# EAGLE board Layer1 (EAGLE 9.6.1), part 1 of 2
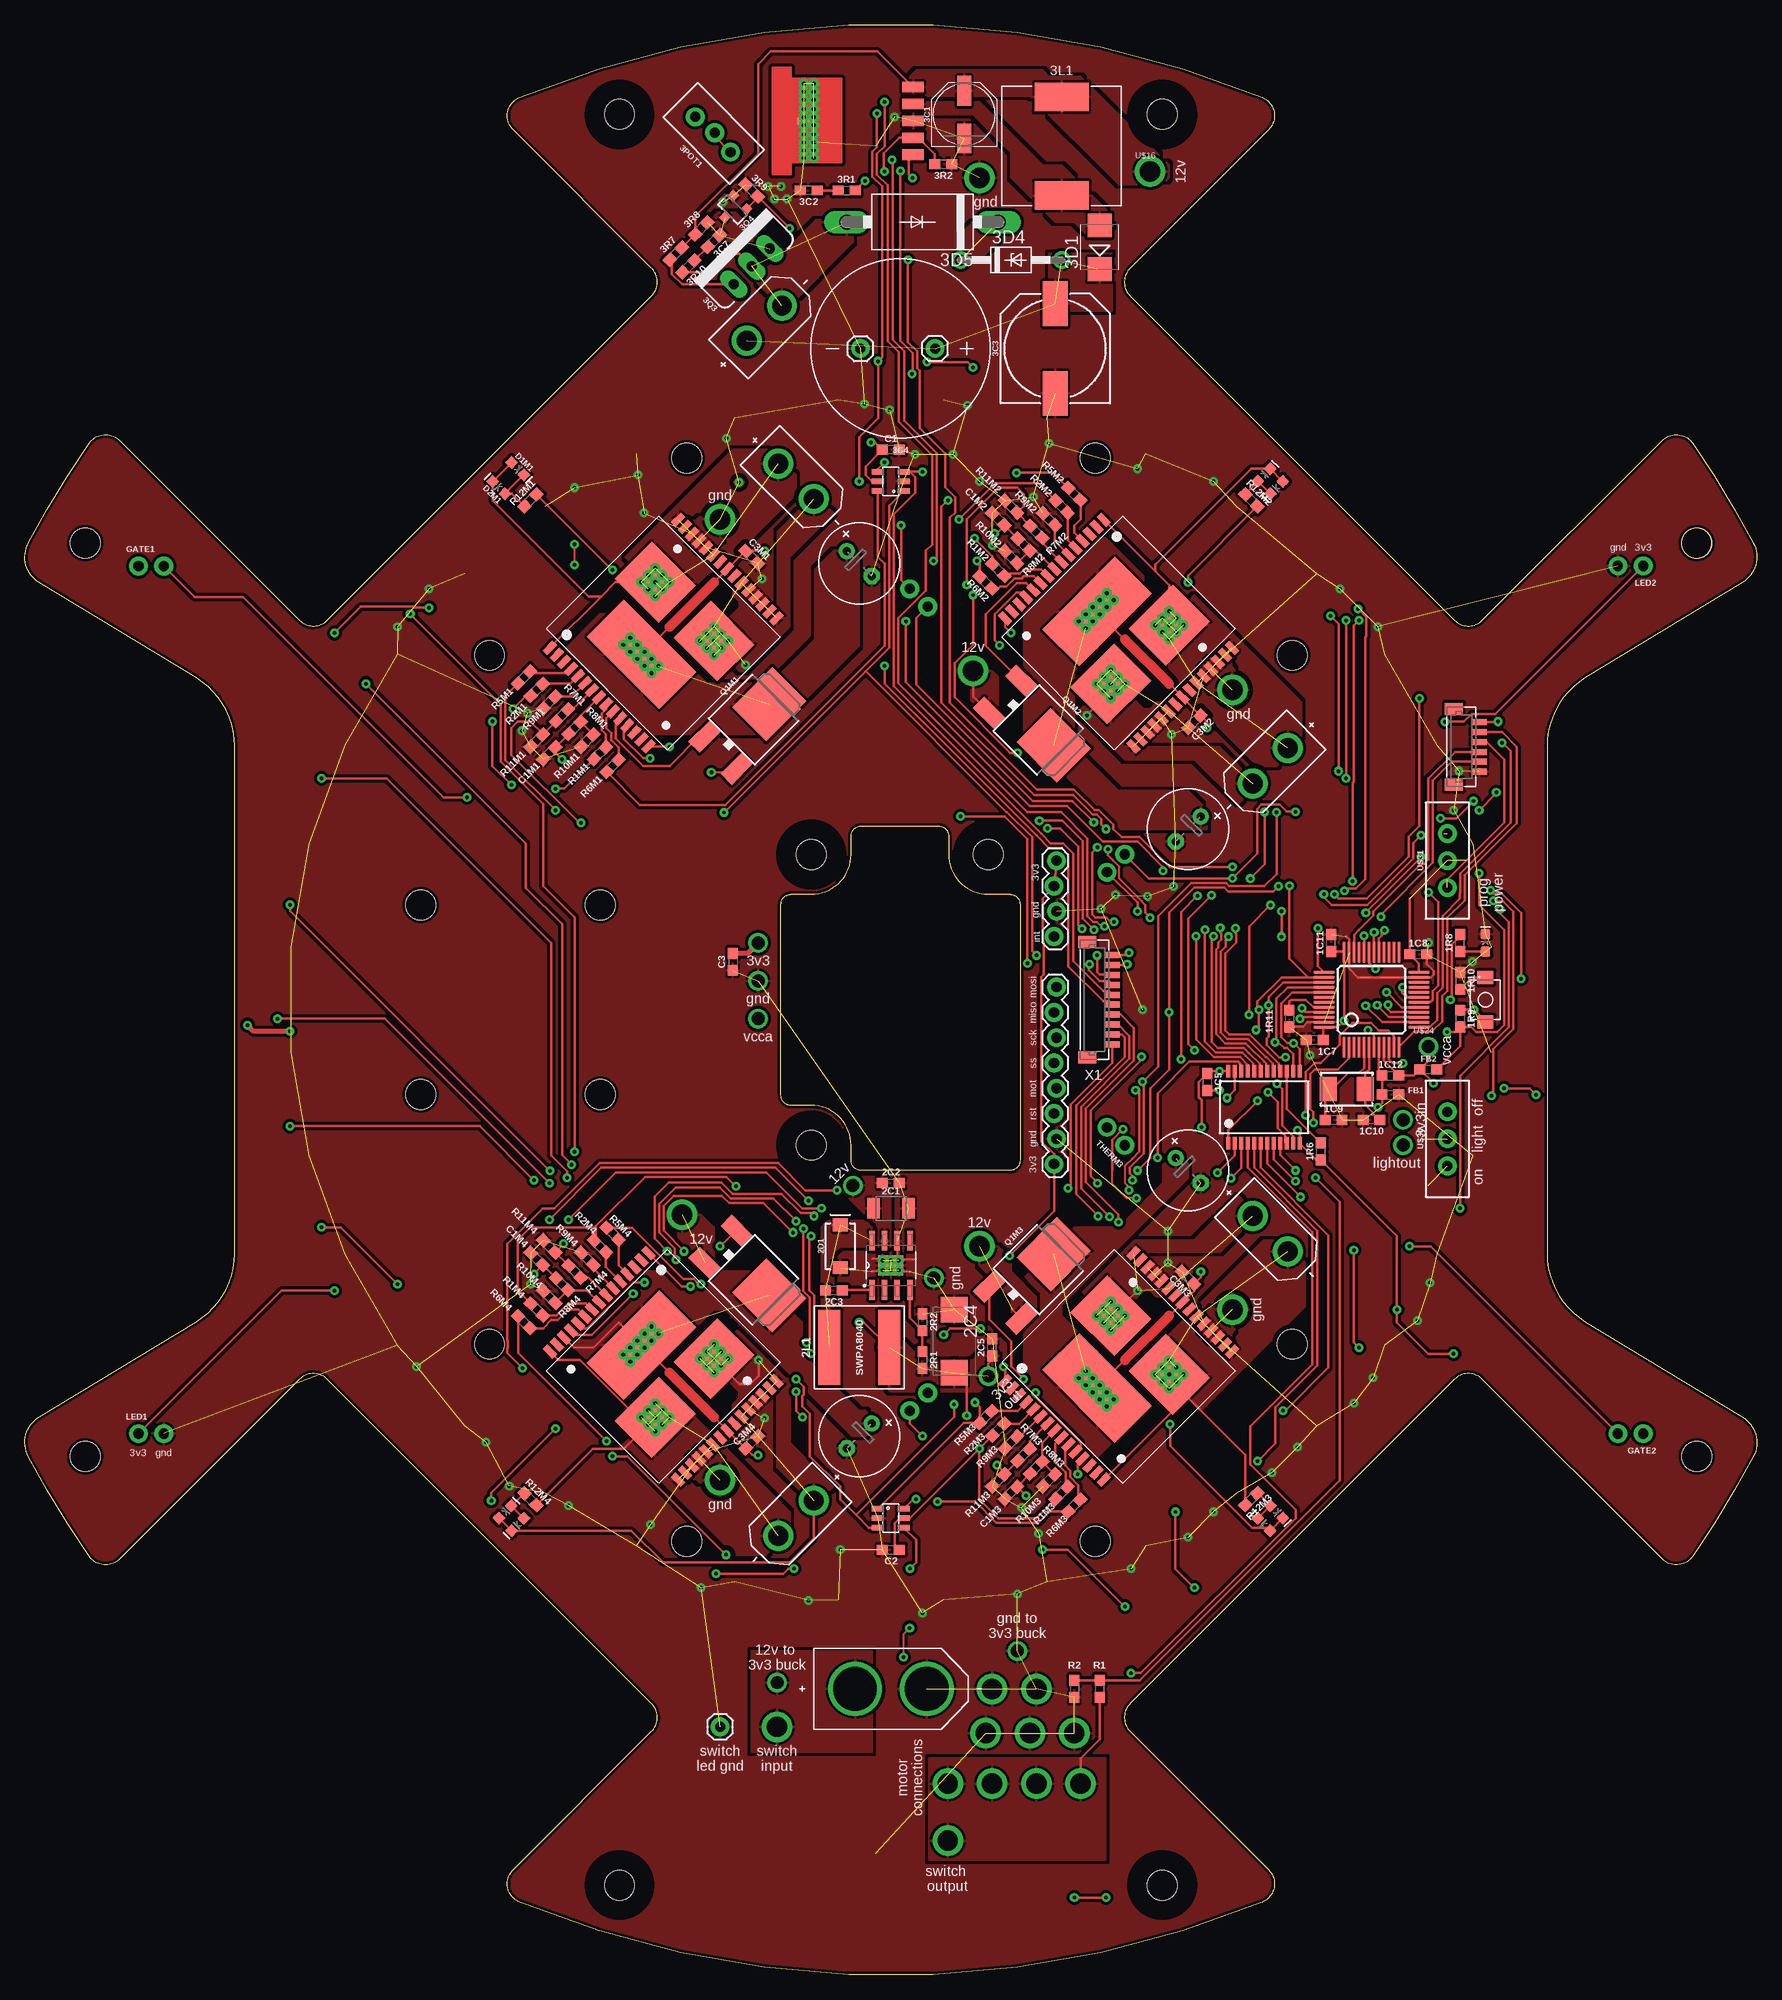
[diagram p5: board, top side]
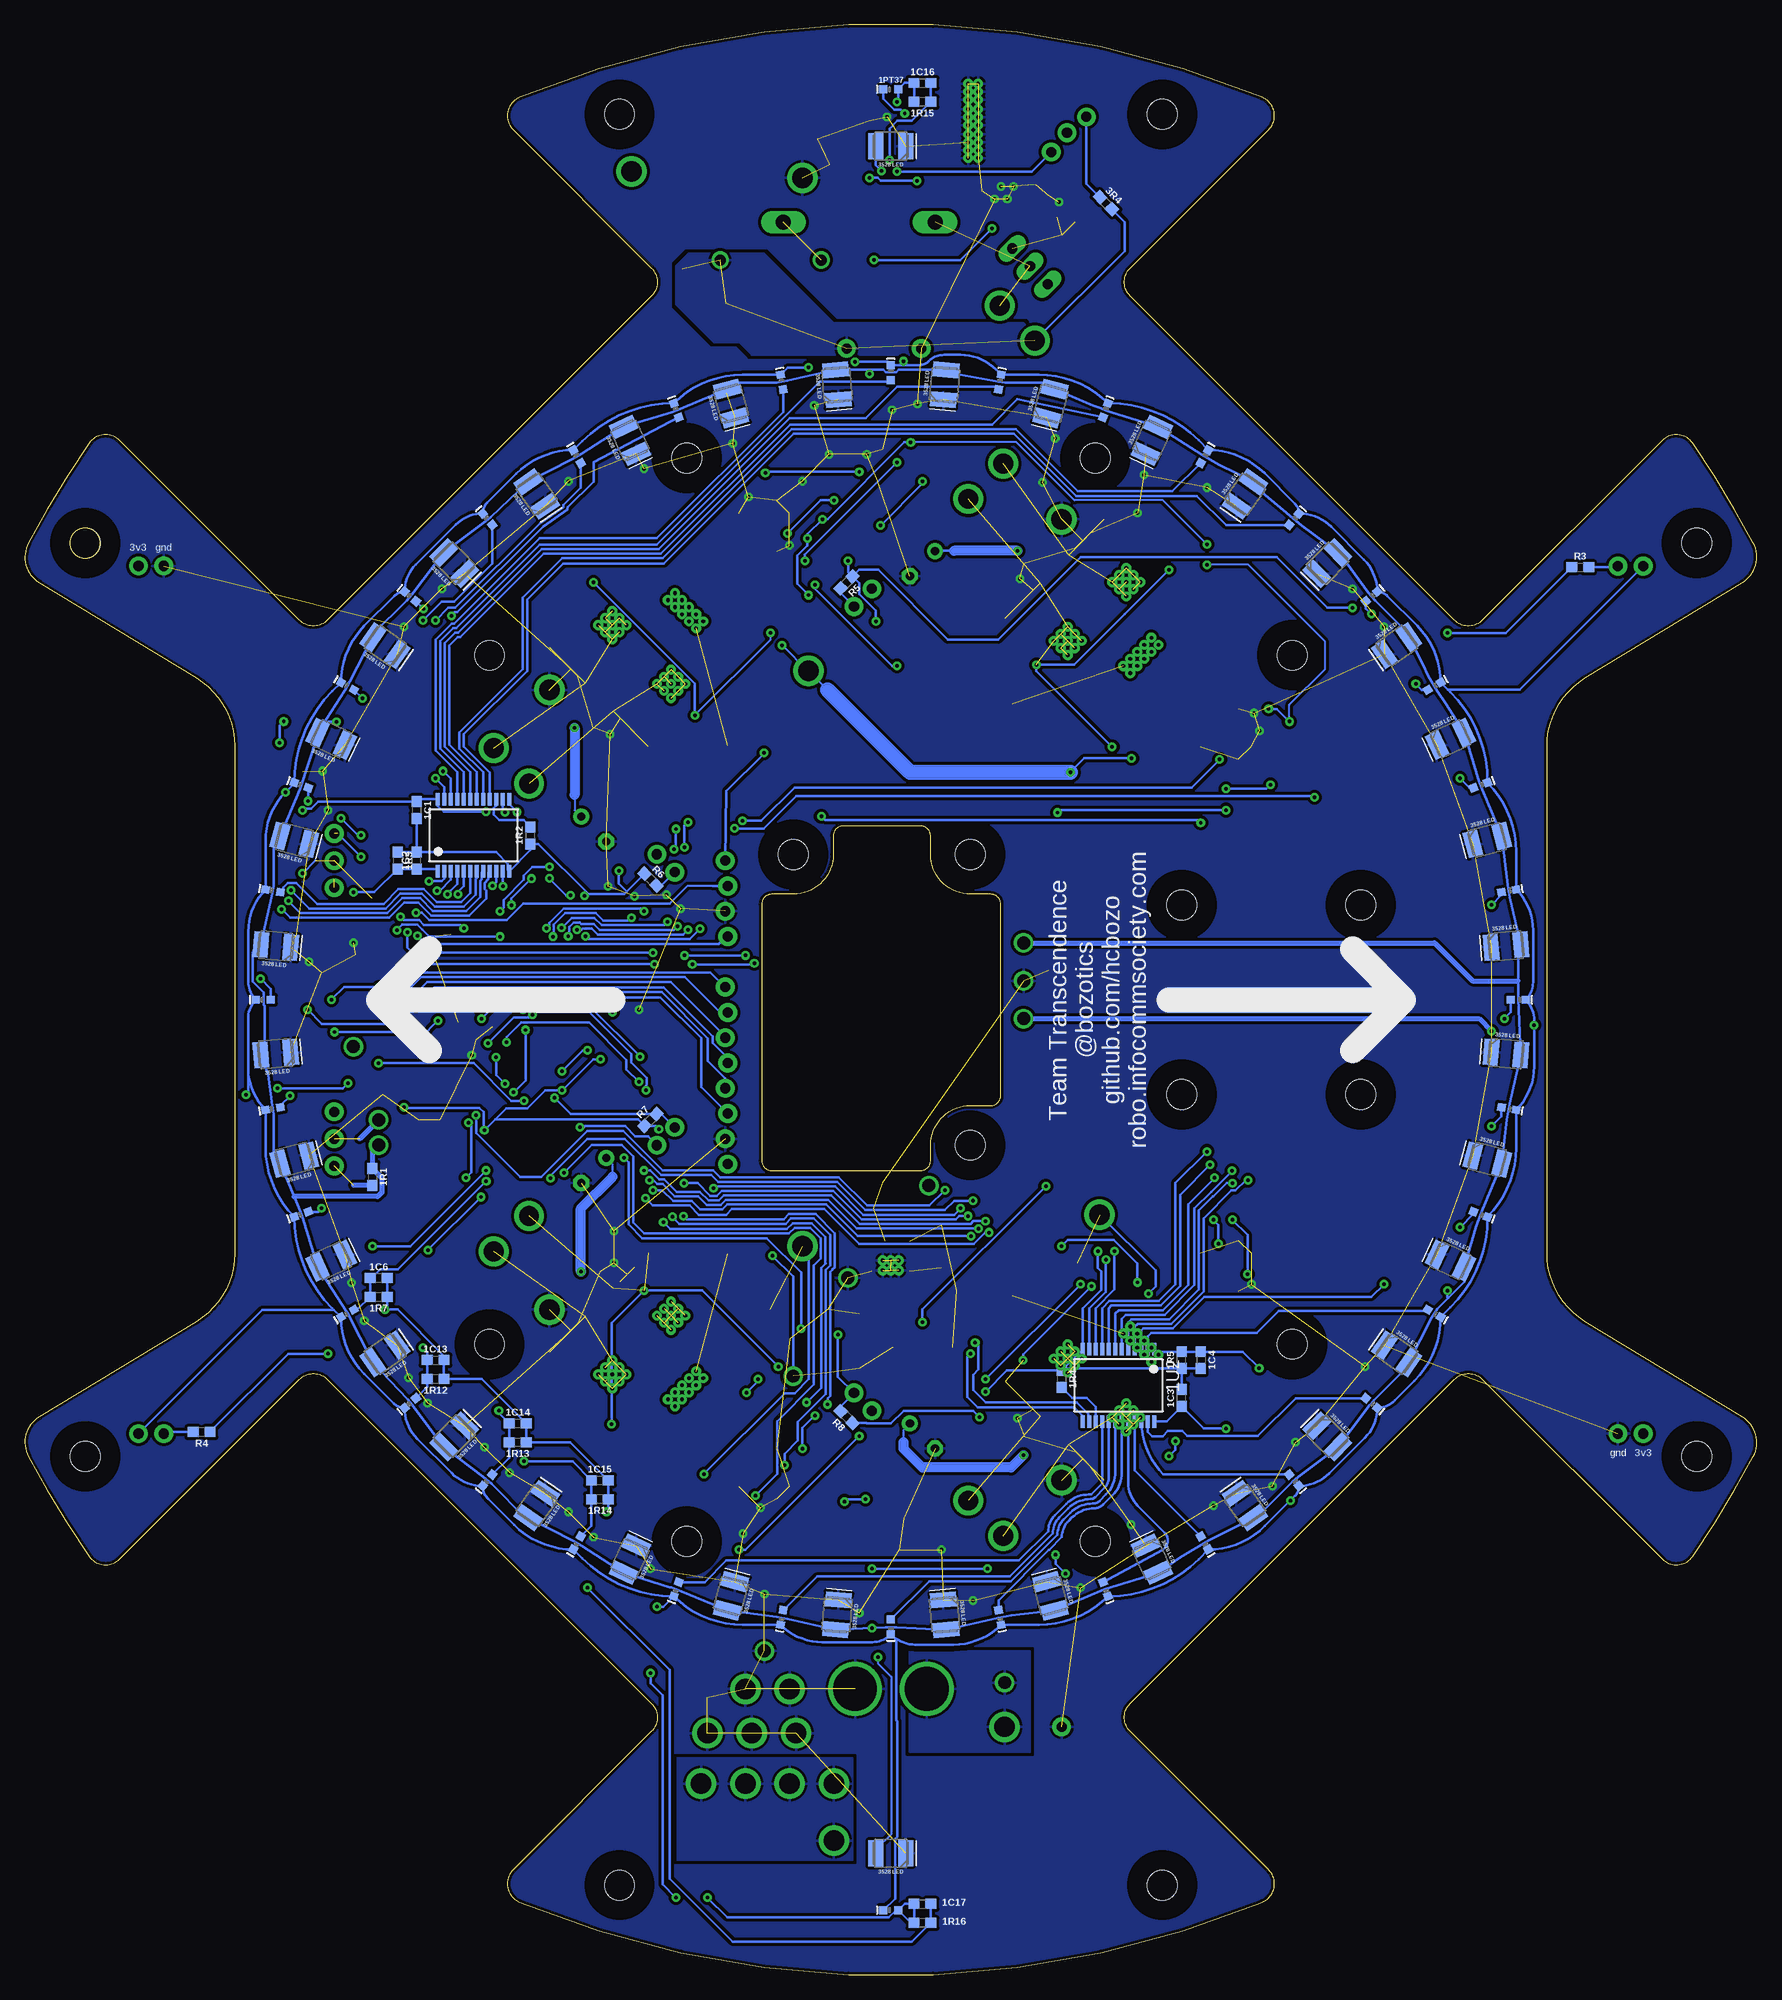
[diagram p6: board, bottom side, seen from below]

Size 173.9 x 195.82 mm. Coordinates in mm from the lower left corner, seen from the top.
Outline: 62.91,27.25 30.38,59.78 arc90 27.55,59.78 9.51,41.74 arc-100 6.46,42.01 arc-7 0.35,52.04 arc-87 1.44,56.01 17.21,65.57 arc59 21.06,72.41 21.06,123.4 arc59 17.21,130.24 1.44,139.81 arc-87 0.35,143.78 arc-7 6.46,153.81 arc-100 9.51,154.08 27.55,136.04 arc90 30.38,136.04 62.91,168.57 arc90 62.91,171.4 49.03,185.28 arc-113 49.68,188.54 arc-45 124.22,188.54 arc-113 124.88,185.28 110.99,171.4 arc90 110.99,168.57 143.52,136.04 arc90 146.35,136.04 164.39,154.08 arc-100 167.44,153.81 arc-7 173.55,143.78 arc-87 172.46,139.81 156.69,130.24 arc59 152.84,123.4 152.84,72.41 arc59 156.69,65.57 172.46,56.01 arc-87 173.55,52.04 arc-7 167.44,42.01 arc-100 164.39,41.74 146.35,59.78 arc90 143.52,59.78 110.99,27.25 arc90 110.99,24.42 124.88,10.54 arc-113 124.22,7.27 arc-45 49.68,7.27 arc-113 49.03,10.54 62.91,24.42 arc90 62.91,27.25
Outline: 82.96,83.3 arc90 78.96,87.3 76.92,87.3 arc-90 75.92,88.3 75.92,107.51 arc-90 76.92,108.51 78.96,108.51 arc90 82.96,112.51 82.96,114.36 arc-90 83.96,115.36 91.74,115.36 arc-90 92.74,114.36 92.74,112.51 arc90 96.74,108.51 98.92,108.51 arc-90 99.92,107.51 99.92,81.76 arc-90 98.92,80.76 83.96,80.76 arc-90 82.96,81.76 82.96,83.3
Outline: circle at 167.86,143.77 radius 1.5
Copper layers (1*16): Top 0.035mm / dielectric 1.5mm / Bottom 0.035mm
Design rules "mine *": minimum track width 8mil, minimum drill 10mil, track to track 8mil, track to pad 8mil, pad to pad 8mil, via to via 8mil, smd to smd 8mil, copper to edge 8mil, drill to drill 8mil, minimum pad ring 12mil, minimum via ring 10mil, stop-mask expansion 4mil, vias tented up to drill 25mil, thermal gap 10mil
Holes 3 mm at 6.04,143.77 6.04,52.05 46.65,63.31 39.76,88.41 57.76,88.41 57.76,107.41 39.76,107.41 78.96,112.51 78.96,83.3 96.74,112.51 46.65,132.5 66.45,152.3 107.46,152.3 127.25,132.5 167.86,143.77 114.2,186.83 59.71,186.83 59.71,8.99 114.2,8.99 107.46,43.51 127.25,63.31 66.45,43.51 167.86,52.05
tKeepout: 20 lines
tRestrict: area 111,183.6 to 117.4,190; area 56.5,183.6 to 62.9,190; area 56.5,5.8 to 62.9,12.2; area 111,5.8 to 117.4,12.2; area 75.8,80.1 to 82.2,86.5; area 75.8,109.3 to 82.2,115.7; area 93.5,109.3 to 99.9,115.7
bRestrict: area 43.4,60.1 to 49.8,66.5; area 63.2,40.3 to 69.6,46.7; area 104.3,40.3 to 110.7,46.7; area 124.1,60.1 to 130.5,66.5; area 124.1,129.3 to 130.5,135.7; area 104.3,149.1 to 110.7,155.5; area 63.2,149.1 to 69.6,155.5; area 43.4,129.3 to 49.8,135.7; area 36.6,104.2 to 43,110.6; area 36.6,85.2 to 43,91.6; area 54.6,85.2 to 61,91.6; area 54.6,104.2 to 61,110.6; area 75.8,80.1 to 82.2,86.5; area 75.8,109.3 to 82.2,115.7; area 93.5,109.3 to 99.9,115.7; area 2.8,48.9 to 9.2,55.3; area 2.8,140.6 to 9.2,147; area 164.7,140.6 to 171.1,147; area 164.7,48.9 to 171.1,55.3; area 56.5,5.8 to 62.9,12.2; area 111,5.8 to 117.4,12.2; area 56.5,183.6 to 62.9,190; area 111,183.6 to 117.4,190
Milling: 20 lines

## Footprints (pad centres in the part's own frame; a part is rotated, then mirrored left to right if it is on the bottom)
C0603 = smd 1.1 x 1: 1 -0.85,0; 2 0.85,0
LED-0603 = smd 1 x 1: A -0.877,0; C 0.877,0
3528 = smd 1.5 x 2.6: A -1.5,0; C 1.5,0
CRYSTAL-SMD-5X3.2-2PAD = smd 1.7 x 2.4: P$1 1.85,0; P$2 -1.85,0
ALS-PT19 = smd 0.8 x 0.8: C -0.75,0; E 0.75,0
R0603 = smd 1.1 x 1: 1 -0.85,0; 2 0.85,0
MOMENTARY_SWITCH_4X3 = smd 1.3 x 1.6: P$1 -2.25,0; P$2 2.25,0
SSOP24 = smd 0.4 x 1.25: 1 -3.575,-3.625; 2 -2.925,-3.625; 3 -2.275,-3.625; 4 -1.625,-3.625; 5 -0.975,-3.625; 6 -0.325,-3.625; 7 0.325,-3.625; 8 0.975,-3.625; 9 1.625,-3.625; 10 2.275,-3.625; 11 2.925,-3.625; 12 3.575,-3.625; 13 3.575,3.625; 14 2.925,3.625; 15 2.275,3.625; 16 1.625,3.625; 17 0.975,3.625; 18 0.325,3.625; 19 -0.325,3.625; 20 -0.975,3.625; 21 -1.625,3.625; 22 -2.275,3.625; 23 -2.925,3.625; 24 -3.575,3.625
LQFP48 = smd 0.254 x 2.032: 1 -2.75,-4.758; 2 -2.25,-4.758; 3 -1.75,-4.758; 4 -1.25,-4.758; 5 -0.75,-4.758; 6 -0.25,-4.758; 7 0.25,-4.758; 8 0.75,-4.758; 9 1.25,-4.758; 10 1.75,-4.758; 11 2.25,-4.758; 12 2.75,-4.758; 25 2.75,4.758; 26 2.25,4.758; 27 1.75,4.758; 28 1.25,4.758; 29 0.75,4.758; 30 0.25,4.758; 31 -0.25,4.758; 32 -0.75,4.758; 33 -1.25,4.758; 34 -1.75,4.758; 35 -2.25,4.758; 36 -2.75,4.758 | smd 2.032 x 0.254: 13 4.758,-2.75; 14 4.758,-2.25; 15 4.758,-1.75; 16 4.758,-1.25; 17 4.758,-0.75; 18 4.758,-0.25; 19 4.758,0.25; 20 4.758,0.75; 21 4.758,1.25; 22 4.758,1.75; 23 4.758,2.25; 24 4.758,2.75; 37 -4.758,2.75; 38 -4.758,2.25; 39 -4.758,1.75; 40 -4.758,1.25; 41 -4.758,0.75; 42 -4.758,0.25; 43 -4.758,-0.25; 44 -4.758,-0.75; 45 -4.758,-1.25; 46 -4.758,-1.75; 47 -4.758,-2.25; 48 -4.758,-2.75
C1210 = smd 1.27 x 2.06: 1 -1.755,0; 2 1.755,0
D/7343-31R = smd 2.55 x 2.7: + 3.175,0; - -3.175,0
SMA-DIODE = smd 1.27 x 1.47: A -2.15,0; C 2.15,0
SWPA8040 = smd 2.2 x 7.5: P1 -3,0; P2 3,0
POWERPAD-SOIC-8 = smd 1.981 x 0.559: 1 -2.464,1.905; 2 -2.464,0.635; 3 -2.464,-0.635; 4 -2.464,-1.905; 5 2.464,-1.905; 6 2.464,-0.635; 7 2.464,0.635; 8 2.464,1.905 | smd 2.007 x 2.489: 9 0,0 | drill 0.381: P$1 -0.5,0.8; P$2 0.5,0.8; P$3 -0.5,0; P$4 0.5,0; P$5 -0.5,-0.8; P$6 0.5,-0.8
PANASONIC_D = smd 3 x 1.4: + 2.4,0; - -2.4,0
10X10.5_CAP = smd 4.5 x 2.5: + 4.5,0; - -4.5,0
1000UF-CAP = drill 1.016 pad 1.88: + 0,0; - 7.5,0
SMB = smd 2.4 x 2.4: A 2.2,0; C -2.2,0
DO41Z10 = drill 1.118: A 5.08,0; C -5.08,0
DO201-15 = drill 1.499 long: A 7.62,0; C -7.62,0
CDRH127 = smd 5.4 x 2.9: 1 0,4.95; 2 0,-4.95
3296-TRIMPOT = drill 1.016 pad 1.88: 1 -2.5,0.127; 2 0,-0.127; 3 2.5,0.127
TO220V = drill 1.016 long: 1 -2.54,0; 2 0,0; 3 2.54,0
SOT23-3 = smd 0.8 x 0.9: 1 -0.95,-1; 2 0.95,-1; 3 0,1.1
TO-263 = smd 2.16 x 1.07: P1 11,-3.4; P2 11,-1.7; P3 11,0; P4 11,1.7; P5 11,3.4 | drill 0.381: P$1 0.008,3.721; P$2 1.008,3.721; P$3 0.008,2.921; P$4 1.008,2.921; P$5 0.008,2.121; P$6 1.008,2.121; P$7 0.008,1.181; P$8 1.008,1.181; P$9 0.008,0.381; P$10 1.008,0.381; P$11 0.008,-0.419; P$12 1.008,-0.419; P$13 0.008,-1.359; P$14 1.008,-1.359; P$15 0.008,-2.159; P$16 1.008,-2.159; P$17 0.008,-2.959; P$18 1.008,-2.959; P$19 0.008,-3.721; P$20 1.008,-3.721 | smd 1.27 x 0.635: TAB 0,0
E3,5-8 = drill 0.813 pad 1.6: + -1.778,0 | drill 0.813 pad 1.6 octagon: - 1.778,0
XT30PB-F = drill 2: + -2.5,0; - 2.5,0
1X02_NO_SILK = drill 1.016 pad 1.88: 1 0,0; 2 2.54,0
1X04_LOCK = drill 1.016 pad 1.88: 1 0,0.127; 2 2.54,-0.127; 3 5.08,0.127; 4 7.62,-0.127
14AWG = drill 2.05: P$1 0,0
1X01 = drill 1.016 pad 1.88: 1 0,0
1X08_LOCK = drill 1.016 pad 1.88: 1 0,0.127; 2 2.54,-0.127; 3 5.08,0.127; 4 7.62,-0.127; 5 10.16,0.127; 6 12.7,-0.127; 7 15.24,0.127; 8 17.78,-0.127
DPAK = smd 1.6 x 3: 1 -2.28,-5.31; 3 2.28,-5.31 | smd 4.826 x 5.715: 4 0,1.588
BM06B-SRSS-TB = smd 0.6 x 1.55: 1 2.5,0; 2 1.5,0; 3 0.5,0; 4 -0.5,0; 5 -1.5,0; 6 -2.5,0 | smd 1.2 x 1.8: M1 3.8,-2.525; M2 -3.8,-2.525
POWERSO-30 = smd 0.65 x 1.4: P1 -7,-9.1; P2 -6,-9.1; P3 -5,-9.1; P4 -4,-9.1; P5 -3,-9.1; P6 -2,-9.1; P7 -1,-9.1; P8 0,-9.1; P9 1,-9.1; P10 2,-9.1; P11 3,-9.1; P12 4,-9.1; P13 5,-9.1; P14 6,-9.1; P15 7,-9.1; P16 7,9.1; P17 6,9.1; P18 5,9.1; P19 4,9.1; P20 3,9.1; P21 2,9.1; P22 1,9.1; P23 0,9.1; P24 -1,9.1; P25 -2,9.1; P26 -3,9.1; P27 -4,9.1; P28 -5,9.1; P29 -6,9.1; P30 -7,9.1 | drill 0.381: P$1 -4.165,3.05; P$2 -3.165,3.05; P$3 -5.165,3.05; P$4 -5.165,2.05; P$5 -4.165,2.05; P$6 -3.165,2.05; P$7 -5.165,4.05; P$8 -4.165,4.05; P$9 -3.165,4.05; P$10 4.165,3.05; P$11 5.165,3.05; P$12 3.165,3.05; P$13 3.165,2.05; P$14 4.165,2.05; P$15 5.165,2.05; P$16 3.165,4.05; P$17 4.165,4.05; P$18 5.165,4.05; P$19 0,-2.669; P$20 -1,-2.669; P$21 1,-2.669; P$22 -2,-2.669; P$23 2,-2.669; P$24 0,-3.669; P$25 1,-3.669; P$26 2,-3.669; P$27 -1,-3.669; P$28 -2,-3.669 | smd 10.3 x 5.25: SLUG1 0,-3.05 | smd 6.23 x 5.25: SLUG2 -4.165,3.05; SLUG3 4.165,3.05
SOT23-6 = smd 0.55 x 1.2: 1 -0.95,-1.3; 2 0,-1.3; 3 0.95,-1.3; 4 0.95,1.3; 5 0,1.3; 6 -0.95,1.3
18AWG = drill 1.3: P$1 0,0
XT60PB-M = drill 4.4: + -3.6,0; - 3.6,0
SWITCH_SPDT_PTH_11.6X4.0MM_LOCK = drill 1.016 pad 1.88: 1 0,2.718; 2 0,0; 3 0,-2.718
BM10B-SRSS-TB = smd 0.6 x 1.55: 1 4.5,0; 2 3.5,0; 3 2.5,0; 4 1.5,0; 5 0.5,0; 6 -0.5,0; 7 -1.5,0; 8 -2.5,0; 9 -3.5,0; 10 -4.5,0 | smd 1.2 x 1.8: M1 5.8,-2.525; M2 -5.8,-2.525

## Placement (x,y rotation side)
1C1  0.1uF  [C0603]  134.58,116.96 270 bottom
1C2  1uF  [C0603]  134.58,111.88 90 bottom
1C3  0.1uF  [C0603]  57.74,57.9 90 bottom
1C4  1uF  [C0603]  55.84,61.71 270 bottom
1C5  0.1uF  [C0603]  118.7,89.65 270 top
1C6  1uF  [C0603]  138.39,69.97 0 bottom
1C7  1uF  [C0603]  129.5,93.84 180 top
1C8  1uF  [C0603]  139.89,102.48 0 top
1C9  20pF  [C0603]  131.4,85.84 0 top
1C10  20pF  [C0603]  135.21,85.84 180 top
1C11  1uF  [C0603]  131.15,103.62 90 top
1C12  1uF  [C0603]  137.12,90.29 0 top
1C13  1uF  [C0603]  132.67,61.71 0 bottom
1C14  1uF  [C0603]  124.42,55.36 0 bottom
1C15  1uF  [C0603]  116.16,49.65 0 bottom
1C16  1uF  [C0603]  83.78,189.98 0 bottom
1C17  1uF  [C0603]  83.78,7.1 0 bottom
1D0  BLUE  [LED-0603]  146.64,103.62 90 top
1D1  3528LED  [3528]  25.19,103.31 185 bottom
1D2  3528LED  [3528]  27.06,113.96 195 bottom
1D3  3528LED  [3528]  30.76,124.11 205 bottom
1D4  3528LED  [3528]  36.16,133.47 215 bottom
1D5  3528LED  [3528]  43.11,141.75 225 bottom
1D6  3528LED  [3528]  51.39,148.7 235 bottom
1D7  3528LED  [3528]  60.75,154.1 245 bottom
1D8  3528LED  [3528]  70.9,157.8 255 bottom
1D9  3528LED  [3528]  81.55,159.67 265 bottom
1D10  3528LED  [3528]  92.35,159.67 275 bottom
1D11  3528LED  [3528]  103,157.8 285 bottom
1D12  3528LED  [3528]  113.15,154.1 295 bottom
1D13  3528LED  [3528]  122.51,148.7 305 bottom
1D14  3528LED  [3528]  130.79,141.75 315 bottom
1D15  3528LED  [3528]  137.74,133.47 325 bottom
1D16  3528LED  [3528]  143.14,124.11 335 bottom
1D17  3528LED  [3528]  146.84,113.96 345 bottom
1D18  3528LED  [3528]  148.71,103.31 355 bottom
1D19  3528LED  [3528]  148.71,92.5 5 bottom
1D20  3528LED  [3528]  146.84,81.86 15 bottom
1D21  3528LED  [3528]  143.14,71.71 25 bottom
1D22  3528LED  [3528]  137.74,62.35 35 bottom
1D23  3528LED  [3528]  130.79,54.07 45 bottom
1D24  3528LED  [3528]  122.51,47.12 55 bottom
1D25  3528LED  [3528]  113.15,41.72 65 bottom
1D26  3528LED  [3528]  103,38.02 75 bottom
1D27  3528LED  [3528]  92.35,36.14 85 bottom
1D28  3528LED  [3528]  81.55,36.14 95 bottom
1D29  3528LED  [3528]  70.9,38.02 105 bottom
1D30  3528LED  [3528]  60.75,41.72 115 bottom
1D31  3528LED  [3528]  51.39,47.12 125 bottom
1D32  3528LED  [3528]  43.11,54.07 135 bottom
1D33  3528LED  [3528]  36.16,62.35 145 bottom
1D34  3528LED  [3528]  30.76,71.71 155 bottom
1D35  3528LED  [3528]  27.06,81.86 165 bottom
1D36  3528LED  [3528]  25.19,92.5 175 bottom
1D38  3528LED  [3528]  86.95,183.63 0 bottom
1D40  3528LED  [3528]  86.95,12.18 0 bottom
1OSC  8MHz  [CRYSTAL-SMD-5X3.2-2PAD]  132.72,88.93 0 top
1PT1  LIGHT_SENSOR_ALS  [ALS-PT19]  23.95,97.91 180 bottom
1PT2  LIGHT_SENSOR_ALS  [ALS-PT19]  24.91,108.85 190 bottom
1PT3  LIGHT_SENSOR_ALS  [ALS-PT19]  27.75,119.46 200 bottom
1PT4  LIGHT_SENSOR_ALS  [ALS-PT19]  32.39,129.41 210 bottom
1PT5  LIGHT_SENSOR_ALS  [ALS-PT19]  38.69,138.4 220 bottom
1PT6  LIGHT_SENSOR_ALS  [ALS-PT19]  46.45,146.17 230 bottom
1PT7  LIGHT_SENSOR_ALS  [ALS-PT19]  55.45,152.47 240 bottom
1PT8  LIGHT_SENSOR_ALS  [ALS-PT19]  65.4,157.11 250 bottom
1PT9  LIGHT_SENSOR_ALS  [ALS-PT19]  76.01,159.95 260 bottom
1PT10  LIGHT_SENSOR_ALS  [ALS-PT19]  86.95,160.91 270 bottom
1PT11  LIGHT_SENSOR_ALS  [ALS-PT19]  97.89,159.95 280 bottom
1PT12  LIGHT_SENSOR_ALS  [ALS-PT19]  108.5,157.11 290 bottom
1PT13  LIGHT_SENSOR_ALS  [ALS-PT19]  118.45,152.47 300 bottom
1PT14  LIGHT_SENSOR_ALS  [ALS-PT19]  127.45,146.17 310 bottom
1PT15  LIGHT_SENSOR_ALS  [ALS-PT19]  135.21,138.4 320 bottom
1PT16  LIGHT_SENSOR_ALS  [ALS-PT19]  141.51,129.41 330 bottom
1PT17  LIGHT_SENSOR_ALS  [ALS-PT19]  146.15,119.46 340 bottom
1PT18  LIGHT_SENSOR_ALS  [ALS-PT19]  148.99,108.85 350 bottom
1PT19  LIGHT_SENSOR_ALS  [ALS-PT19]  149.95,97.91 0 bottom
1PT20  LIGHT_SENSOR_ALS  [ALS-PT19]  148.99,86.97 10 bottom
1PT21  LIGHT_SENSOR_ALS  [ALS-PT19]  146.15,76.36 20 bottom
1PT22  LIGHT_SENSOR_ALS  [ALS-PT19]  141.51,66.41 30 bottom
1PT23  LIGHT_SENSOR_ALS  [ALS-PT19]  135.21,57.41 40 bottom
1PT24  LIGHT_SENSOR_ALS  [ALS-PT19]  127.45,49.65 50 bottom
1PT25  LIGHT_SENSOR_ALS  [ALS-PT19]  118.45,43.35 60 bottom
1PT26  LIGHT_SENSOR_ALS  [ALS-PT19]  108.5,38.71 70 bottom
1PT27  LIGHT_SENSOR_ALS  [ALS-PT19]  97.89,35.87 80 bottom
1PT28  LIGHT_SENSOR_ALS  [ALS-PT19]  86.95,34.91 90 bottom
1PT29  LIGHT_SENSOR_ALS  [ALS-PT19]  76.01,35.87 100 bottom
1PT30  LIGHT_SENSOR_ALS  [ALS-PT19]  65.4,38.71 110 bottom
1PT31  LIGHT_SENSOR_ALS  [ALS-PT19]  55.45,43.35 120 bottom
1PT32  LIGHT_SENSOR_ALS  [ALS-PT19]  46.45,49.65 130 bottom
1PT33  LIGHT_SENSOR_ALS  [ALS-PT19]  38.69,57.41 140 bottom
1PT34  LIGHT_SENSOR_ALS  [ALS-PT19]  32.39,66.41 150 bottom
1PT35  LIGHT_SENSOR_ALS  [ALS-PT19]  27.75,76.36 160 bottom
1PT36  LIGHT_SENSOR_ALS  [ALS-PT19]  24.91,86.97 170 bottom
1PT37  LIGHT_SENSOR_ALS  [ALS-PT19]  86.95,189.35 0 bottom
1PT38  LIGHT_SENSOR_ALS  [ALS-PT19]  86.95,6.47 0 bottom
1R1  0.39  [R0603]  139.02,80.13 270 bottom
1R2  10k  [R0603]  123.15,114.42 90 bottom
1R3  3k  [R0603]  136.48,111.88 270 bottom
1R4  10k  [R0603]  69.81,59.81 270 bottom
1R5  3k  [R0603]  57.74,61.71 90 bottom
1R6  10k  [R0603]  130.13,82.67 90 top
1R7  3k  [R0603]  138.39,68.06 180 bottom
1R8  1k  [R0603]  144.1,103.62 90 top
1R9  10k  [R0603]  144.1,96 270 top
1R10  1k  [R0603]  144.1,99.81 270 top
1R11  10k  [R0603]  126.96,96 270 top
1R12  3k  [R0603]  132.67,59.81 180 bottom
1R13  3k  [R0603]  124.42,53.46 180 bottom
1R14  3k  [R0603]  116.16,47.74 180 bottom
1R15  3k  [R0603]  83.78,188.08 180 bottom
1R16  3k  [R0603]  83.78,5.2 180 bottom
1SW1  MOMENTARY_SWITCH_4X3  [MOMENTARY_SWITCH_4X3]  146.64,97.91 270 top
1U1  [SSOP24]  128.86,114.42 0 bottom
1U2  [SSOP24]  64.09,59.17 180 bottom
1U3  [SSOP24]  124.42,87.11 0 top
1U4  STM32F103CBT6  [LQFP48]  135.21,97.91 0 top
2C1  22.0uF  [C1210]  86.95,76.95 0 top
2C2  4.7uF  [C0603]  86.95,79.49 0 top
2C3  10.0nF  [C0603]  81.24,68.7 180 top
2C4  330uF  [D/7343-31R]  93.3,63.62 270 top
2C5  0.1uF  [C0603]  97.11,62.98 90 top
2D1  SS54  [SMA-DIODE]  81.87,73.14 90 top
2L1  10uH  [SWPA8040]  83.78,62.98 0 top
2R1  10k  [R0603]  90.13,61.71 270 top
2R2  5.9k  [R0603]  90.13,65.52 270 top
2U1  TPS5430  [POWERPAD-SOIC-8]  86.95,71.24 90 top
3C1  100uF  [PANASONIC_D]  94.32,186.81 90 top
3C2  1uF  [C0603]  78.7,179.19 180 top
3C3  CAPACITOR_POL_10X10.5MM  [10X10.5_CAP]  103.46,163.31 90 top
3C4  1000uF/63V  [1000UF-CAP]  91.4,163.31 180 top
3C7  1500pF  [C0603]  69.17,174.11 45 top
3D1  SS510  [SMB]  107.91,173.47 90 top
3D4  DIODE-ZENER  [DO41Z10]  99.02,172.2 0 top
3D5  1N5401  [DO201-15]  90.13,176.01 180 top
3L1  56uH  [CDRH127]  104.1,183.63 0 top
3POT1  10k  [3296-TRIMPOT]  69.17,184.9 135 top
3Q3  STP75NF75  [TO220V]  72.98,171.57 45 top
3Q4  AO3400  [SOT23-3]  71.08,177.28 135 top
3R1  2.94k  [R0603]  82.51,179.19 0 top
3R2  1.5k  [R0603]  92.21,181.82 180 top
3R4  57k  [R0603]  65.36,177.92 315 bottom
3R7  1k  [R0603]  65.36,172.84 225 top
3R8  10k  [R0603]  67.9,175.38 225 top
3R9  10k  [R0603]  72.98,179.19 315 top
3R10  20  [R0603]  66.63,171.57 225 top
3U1  LM2587  [TO-263]  78.19,186.17 0 top
C1  0.1uF  [C0603]  86.95,153.15 0 top
C1M1  33nF  [C0603]  52.66,122.67 45 top
C1M2  33nF  [C0603]  97.75,146.17 315 top
C1M3  33nF  [C0603]  99.02,48.38 45 top
C1M4  33nF  [C0603]  51.39,71.87 315 top
C2  0.1uF  [C0603]  86.95,42.66 180 top
C2M1  680uF  [E3,5-8]  83.78,141.72 315 top
C2M2  680uF  [E3,5-8]  116.8,115.05 225 top
C2M3  680uF  [E3,5-8]  116.8,80.76 315 top
C2M4  680uF  [E3,5-8]  83.78,54.09 225 top
C3  1uF  [C0603]  71.08,101.72 270 top
C3M1  1uF  [C0603]  72.98,142.36 315 top
C3M2  1uF  [C0603]  117.43,125.85 225 top
C3M3  1uF  [C0603]  116.8,69.97 135 top
C3M4  1uF  [C0603]  72.98,53.46 45 top
CONN_M1  XT30PB-F  [XT30PB-F]  77.43,149.98 315 top
CONN_M2  XT30PB-F  [XT30PB-F]  125.05,121.4 225 top
CONN_M3  XT30PB-F  [XT30PB-F]  125.05,74.41 315 top
CONN_M4  XT30PB-F  [XT30PB-F]  77.43,45.84 225 top
D1M1  GREEN  [LED-0603]  49.49,151.25 315 top
D1M2  GREEN  [LED-0603]  125.69,149.34 225 top
D1M3  GREEN  [LED-0603]  124.42,45.2 135 top
D1M4  GREEN  [LED-0603]  48.22,46.47 45 top
D2M1  RED  [LED-0603]  47.58,149.34 135 top
D2M2  RED  [LED-0603]  124.42,150.61 45 top
D2M3  RED  [LED-0603]  125.69,46.47 315 top
D2M4  RED  [LED-0603]  49.49,45.2 225 top
FB1  FERRITE_BEAD  [R0603]  137.12,88.38 0 top
FB2  FERRITE_BEAD  [R0603]  140.93,90.92 0 top
GATE1  [1X02_NO_SILK]  11.41,141.47 0 top
GATE2  [1X02_NO_SILK]  162.49,54.33 180 top
J1  XT30PB-F  [XT30PB-F]  74.25,165.85 45 top
J2  [1X04_LOCK]  103.46,104.26 90 top
J3  14AWG  [14AWG]  66,76.32 0 top
J4  14AWG  [14AWG]  95.84,73.14 0 top
J5  14AWG  [14AWG]  95.21,130.93 0 top
J6  14AWG  [14AWG]  96.48,24.25 90 top
J7  14AWG  [14AWG]  75.52,24.88 0 top
J8  14AWG  [14AWG]  92.67,13.45 90 top
J9  14AWG  [14AWG]  97.11,19.17 90 top
J10  14AWG  [14AWG]  101.56,19.17 90 top
J11  14AWG  [14AWG]  106,19.17 90 top
J12  [1X01]  69.81,24.88 0 top
J13  14AWG  [14AWG]  100.92,24.25 90 top
J14  14AWG  [14AWG]  97.11,28.69 90 top
J15  14AWG  [14AWG]  101.56,28.69 90 top
J16  14AWG  [14AWG]  69.81,146.17 0 top
J17  14AWG  [14AWG]  69.81,49.65 0 top
J18  14AWG  [14AWG]  121.24,66.79 0 top
J19  14AWG  [14AWG]  121.24,129.02 0 top
J20  14AWG  [14AWG]  92.67,19.17 90 top
J21  14AWG  [14AWG]  105.37,24.25 0 top
LED1  [1X02_NO_SILK]  11.41,54.33 0 top
LED2  [1X02_NO_SILK]  162.49,141.48 180 top
MOUSE  [1X08_LOCK]  103.46,81.4 90 top
Q1M1  AOD482  [DPAK]  73.62,126.48 315 top
Q1M2  AOD482  [DPAK]  102.19,124.58 225 top
Q1M3  AOD482  [DPAK]  102.19,71.24 315 top
Q1M4  AOD482  [DPAK]  73.62,69.33 225 top
R1  30k  [R0603]  107.91,28.69 270 top
R1M1  3.24k  [R0603]  57.74,122.67 225 top
R1M2  3.24k  [R0603]  97.75,141.09 135 top
R1M3  3.24k  [R0603]  104.1,48.38 225 top
R1M4  3.24k  [R0603]  51.39,66.79 135 top
R2  10k  [R0603]  105.37,28.69 270 top
R2M1  3.24k  [R0603]  51.39,129.02 225 top
R2M2  3.24k  [R0603]  104.1,147.44 135 top
R2M3  3.24k  [R0603]  97.75,54.73 225 top
R2M4  3.24k  [R0603]  57.74,73.14 135 top
R3  4.7k  [R0603]  17.74,141.34 0 bottom
R4  4.7k  [R0603]  156.17,54.49 180 bottom
R5  3.9k  [R0603]  91.4,139.82 225 bottom
R5M1  1k  [R0603]  50.12,130.29 45 top
R5M2  1k  [R0603]  105.37,148.71 315 top
R5M3  1k  [R0603]  96.48,56 45 top
R5M4  1k  [R0603]  59.01,74.41 315 top
R6  3.9k  [R0603]  111.08,109.97 315 bottom
R6M1  1k  [R0603]  59.01,121.4 225 top
R6M2  1k  [R0603]  96.48,139.82 135 top
R6M3  1k  [R0603]  105.37,47.11 225 top
R6M4  1k  [R0603]  50.12,65.52 135 top
R7  3.9k  [R0603]  111.08,85.84 45 bottom
R7M1  1k  [R0603]  53.93,126.48 225 top
R7M2  1k  [R0603]  101.56,144.9 135 top
R7M3  1k  [R0603]  100.29,52.19 225 top
R7M4  1k  [R0603]  55.2,70.6 135 top
R8  3.9k  [R0603]  91.4,56 135 bottom
R8M1  10k  [R0603]  55.2,125.21 45 top
R8M2  10k  [R0603]  100.29,143.63 315 top
R8M3  10k  [R0603]  101.56,50.92 45 top
R8M4  10k  [R0603]  53.93,69.33 315 top
R9M1  10k  [R0603]  52.66,127.75 225 top
R9M2  10k  [R0603]  102.83,146.17 135 top
R9M3  10k  [R0603]  99.02,53.46 225 top
R9M4  10k  [R0603]  56.47,71.87 135 top
R10M1  1k  [R0603]  56.47,123.94 45 top
R10M2  1k  [R0603]  99.02,142.36 315 top
R10M3  1k  [R0603]  102.83,49.65 45 top
R10M4  1k  [R0603]  52.66,68.06 315 top
R11M1  10k  [R0603]  51.39,123.94 45 top
R11M2  10k  [R0603]  99.02,147.44 315 top
R11M3  10k  [R0603]  97.75,49.65 45 top
R11M4  10k  [R0603]  52.66,73.14 315 top
R12M1  4.7k  [R0603]  50.76,148.07 45 top
R12M2  4.7k  [R0603]  123.15,148.07 315 top
R12M3  4.7k  [R0603]  123.15,47.74 225 top
R12M4  4.7k  [R0603]  50.76,47.74 315 top
SWD  BM06B-SRSS-TB  [BM06B-SRSS-TB]  146.01,123.31 270 top
THERM1  [1X02_NO_SILK]  88.86,139.18 315 top
THERM2  [1X02_NO_SILK]  110.45,112.51 225 top
THERM3  [1X02_NO_SILK]  110.45,83.3 135 top
THERM4  [1X02_NO_SILK]  88.86,56.63 45 top
U1M1  VNH5019  [POWERSO-30]  64.09,134.74 315 top
U1M2  VNH5019  [POWERSO-30]  109.81,134.74 225 top
U1M3  VNH5019  [POWERSO-30]  109.81,61.08 315 top
U1M4  VNH5019  [POWERSO-30]  64.09,61.08 225 top
U$4  74LVC2G  [SOT23-6]  86.95,149.98 90 top
U$5  74LVC2G  [SOT23-6]  86.95,45.84 270 top
U$15  18AWG  [18AWG]  83.14,79.24 0 top
U$16  14AWG  [14AWG]  112.99,181.09 0 top
U$17  18AWG  [18AWG]  73.62,103.62 0 top
U$18  18AWG  [18AWG]  73.62,99.81 0 top
U$19  18AWG  [18AWG]  73.62,96 0 top
U$21  18AWG  [18AWG]  75.52,29.33 0 top
U$22  18AWG  [18AWG]  138.39,83.3 0 top
U$23  18AWG  [18AWG]  91.27,69.97 0 top
U$24  18AWG  [18AWG]  140.93,93.21 0 top
U$25  18AWG  [18AWG]  99.65,32.5 90 top
U$26  XT60XT60PB-M  [XT60PB-M]  86.95,28.69 0 top
U$27  18AWG  [18AWG]  138.39,85.84 0 top
U$28  18AWG  [18AWG]  96.75,60.11 0 top
U$29  14AWG  [14AWG]  95.84,180.46 0 top
U$30  SWITCH_SPDT_TH  [SWITCH_SPDT_PTH_11.6X4.0MM_LOCK]  142.83,83.94 0 top
U$31  SWITCH_SPDT_TH  [SWITCH_SPDT_PTH_11.6X4.0MM_LOCK]  142.83,111.88 0 top
X1  BM10B-SRSS-TB  [BM10B-SRSS-TB]  109.18,97.91 270 top

## Tracks (layer width: path | path; a pad name or v marks a point on that pad's centre or on a via)
3.3V  (via drill 0.35)  (4 unrouted)
  Top 0.203: v55.2,141.6 v55.2,143.63
  Top 0.254: C2.1 87.32,43.14 87.32,45.3 87.86,45.84 U$5.5 88.86,45.84 v95.84,52.82 | 2L1.P2 84.24,65.52 v83.78,65.52 | R2M4.2 57.34,73.94 57.34,75.05 | 57.34,75.05 57.34,75.19 62.28,80.13 70.44,80.13 v71.39,79.18 | 57.34,75.05 50.76,75.05 49.49,73.78 49.49,68.7 R1M4.2 | R1M3.2 101.56,45.84 97.75,45.84 95.84,47.74 v95.84,52.82 | v95.84,52.82 R2M3.2 | 2C4.+ 94.57,59.17 v94.57,56.16 | v95.84,52.82 | U$28.P$1 96.75,61.36 97.11,61.71 2C5.1 | J2.4 J2.3 102.19,108.07 102.19,103.73 102.32,103.61 102.32,100.45 102.06,100.19 102.06,83.67 103.33,82.4 MOUSE.1 103.33,76.69 v98.85,72.2 | v134.63,106.66 140.17,112.19 v140.17,112.28 | R1M1.2 54.18,119.11 v53.3,119.11 | v48.85,119.5 46.95,121.4 v46.95,125.85 | v49.01,127.12 50.31,128.42 R2M1.2 | U$4.5 85.05,149.98 84.41,150.61 84.41,151.46 C1.1 85.36,153.9 v84.96,153.9 | R2M2.2 103.49,148.05 101.74,149.8 97.44,149.8 v93.81,146.17 | v95.33,144.26 97.14,142.45 R1M2.2 | v95.21,138.55 95.21,133.56 93.34,131.7 93.34,128.29 98.93,122.7 v99.67,122.7
  Bottom 0.203: v46.95,125.85 46.95,127.53 43.34,131.13 43.34,133.87 51.07,141.6 v55.2,141.6 | v55.2,143.63 59.65,148.07 68.52,148.07 74.35,153.9 85.05,153.9 | 104.82,109.34 107.39,109.34 109.18,107.55
  Bottom 0.254: v83.78,65.52 83.78,66.79 v71.39,79.18 | v94.57,56.16 95.84,54.89 v95.84,52.82 | v140.17,112.28 142.48,114.6 | v53.3,119.11 49.24,119.11 v48.85,119.5 | v46.95,125.85 48.22,127.12 v49.01,127.12 | v95.21,138.55 96.35,139.69 96.35,142.5 95.33,143.52 v95.33,144.26 95.33,144.65 v93.81,146.17 93.31,146.17 85.58,153.9 85.05,153.9 v84.96,153.9 | J2.4 103.46,118.86 99.67,122.65 v99.67,122.7 | J2.3 104.82,109.34 | 109.18,107.55 123.86,107.55 125.52,105.89 133.31,105.89 134.07,106.66 v134.63,106.66 | U$28.P$1 96.75,70.11 v98.85,72.2
  pour Top (isolate 0.305, rank 3): 85.68,66.16 90.13,61.71 95.21,61.71 96.48,62.98 97.11,62.98 97.75,62.35 97.75,60.44 95.84,58.54 86.95,58.54 85.68,59.81
3.3V_MCU  (via drill 0.35)  (2 unrouted)
  Top 0.254: 1C7.1 130.35,95.05 1U4.48 131.83,95.16 132.46,95.79 | 1C11.1 132.35,102.77 1U4.36 132.46,95.79 | 139.04,108.09 1C8.1 139.97,101.55 1U4.24 | 1R9.2 144.1,93.25 FB2.2 | 1R9.2 145.23,95.15 145.7,94.68 147.86,94.68 148.55,95.37 148.55,104.89 146.01,107.43 v146.01,110.61 | 1R9.2 143.62,94.67 v142.81,94.67 | v132.44,95.81 132.46,95.79
  Bottom 0.254: v146.01,110.61 144.74,111.88 | v142.81,94.67 135.75,94.67 135.16,94.08 134.17,94.08 v132.44,95.81
3.3V_PROG  (1 unrouted)
  Top 0.254: SWD.4 146.78,123.81 148.55,122.04 148.55,115.71 142.83,110
12V
  pour Top (isolate 0.305, rank 2): 82.19,78.54 85.68,75.05 85.68,73.14 86.95,73.14 86.95,80.13 83.78,80.13
33  (via drill 0.35)
  Top 0.254: 1R8.2 144.1,104.29 143.27,103.46 143.27,98.07 v143.12,97.92 | v138.32,99.18 138.32,98.61 138.56,98.37 138.57,98.37 138.78,98.16 1U4.19
  Bottom 0.254: v143.12,97.92 141.86,99.18 v138.32,99.18
AGND  (via drill 0.35)
  Top 0.203: v111.6,77.99 110.59,77.99 109.18,79.4 109.18,80.76
  Top 0.254: 1U4.8 135.96,90.59 1C12.1 FB1.1 136.27,87.53 v135.85,87.12 | 1C5.2 v119.97,88.8 | v127.78,84.8 127.99,84.58 1U3.12 129.66,81.82 1R6.1 137.75,74.2 v137.75,66.79 137.75,65.52 140.93,62.35 v143.47,62.35 | v117.43,38.85 115.53,40.76 v115.53,46.47 | v66.16,72.63 66.16,72.69 64.13,74.72 64.13,77.19 65.17,78.22 69.98,78.22 70.7,77.5 74.14,77.5 v77.11,74.54 | v110.26,84.92 v110.26,84.91 109.18,83.83 109.18,80.76 | v77.43,58.54 77.43,56.63 v78.06,56 | v116.09,91.93 116.09,106.73 v117.73,108.37 | v40.6,137.28 39.13,137.28 39,137.4 33.73,137.4 v31.07,134.74 | v87.07,182.24 87.14,182.17 87.14,164.2 88.29,163.05 88.29,156.09 91.57,152.81 91.57,142.28 v91.25,141.97 | v88.45,135.9 88.45,129.8 100.91,117.34 104.65,117.34 108.2,113.78 111.72,113.78 114.26,111.24 v114.26,110.86
  Bottom 0.254: 126.7,85.88 v127.78,84.8 127.84,84.86 127.84,86.61 128.29,87.06 135.79,87.06 v135.85,87.12 | 126.7,85.88 125.59,86.99 123.47,86.99 121.65,88.8 v119.97,88.8 116.85,91.93 v116.09,91.93 | 1C17.2 1R16.1 84.83,3.29 102.83,3.29 109.18,9.64 109.18,30.6 v117.43,38.85 | 1C6.2 1R7.1 137.54,67.01 v137.75,66.79 136.48,66.79 131.82,62.13 1C13.2 1R12.1 128.01,59.81 1C14.2 1R13.1 119.12,53.46 1C15.2 1R14.1 115.31,46.69 v115.53,46.47 | R4.1 147.46,62.35 v143.47,62.35 | 1C4.2 1R5.1 | 1R5.1 1C3.2 | 1R4.1 1U2.12 67.67,66.92 65.82,68.77 65.82,70.6 66.16,70.95 v66.16,72.63 | 1R5.1 69.6,60.86 1R4.1 | v77.11,74.54 77.48,74.54 78.61,73.41 90.15,73.41 93.61,76.87 102.9,76.87 103.46,76.32 106.22,76.32 107.14,77.24 110.85,77.24 v111.6,77.99 | v110.26,84.92 110.58,85.24 R7.1 112.32,85.88 126.7,85.88 | R8.1 89.42,55.4 89.38,55.36 86.95,55.36 85.68,56.63 78.7,56.63 v78.06,56 | 1R4.1 75.31,60.66 v77.43,58.54 | 1C2.2 1R3.1 | 1C2.2 1C1.2 | 1C2.2 126.58,112.73 125.41,111.56 125.41,110.91 1U1.12 123.15,112.93 1R2.1 122.33,113.57 117.29,108.52 | 117.29,108.52 117.58,108.52 v117.73,108.37 | 117.29,108.52 113.73,108.52 | 113.73,108.52 113.46,108.79 | 113.46,108.79 R6.1 | R3.1 25.19,134.74 v31.07,134.74 | v40.6,137.28 43.14,137.28 48.22,142.36 67.9,142.36 76.16,134.1 81.24,134.1 88.22,141.09 90.13,141.09 R5.1 | 1C16.2 1R15.1 84.83,186.17 86.32,186.17 87.07,185.41 v87.07,182.24 | v91.25,141.97 91.25,140.88 R5.1 | R5.1 90.13,139.75 90.13,138.66 88.45,136.98 v88.45,135.9 | v114.26,110.86 114.26,109.59 113.46,108.79 | 113.73,108.52
BATT_LVL  (via drill 0.35)
  Top 0.254: 1U4.2 132.92,93.11 132.92,92 131.84,90.92 129.51,90.92 129.05,90.46 129.05,86.93 129.36,86.61 v129.36,85.57 v129.37,85.56 | R2.1 R1.1 111.93,29.54 132.04,49.65 132.04,77.59 v129.6,80.03
  Bottom 0.254: v129.37,85.56 129.06,85.25 129.06,80.56 v129.6,80.03
CPM1
  Top 0.254: Q1M1.1 67.66,124.34 64.73,121.4 62.1,121.4 59.35,124.16 59.35,125.76 U1M1.P11
CPM2
  Top 0.254: U1M2.P11 100.54,139.77 99.6,139.77 96.48,136.64 96.48,133.47 100,129.95 Q1M2.1
CPM3  (via drill 0.35)
  Top 0.254: U1M3.P11 106,53.03 106,53.48 101.46,58.02 v101.46,58.44 | v100.29,59.81 99.02,61.08 99.02,63.62 96.82,65.81 Q1M3.1
  Bottom 0.254: v101.46,58.44 100.29,59.62 v100.29,59.81
CPM4  (via drill 0.35)
  Top 0.254: U1M4.P11 56.04,64.89 56.49,64.89 61.12,69.52 v62.2,69.52 | v69.81,73.14 71.36,74.7 Q1M4.1
  Bottom 0.254: v62.2,69.52 62.2,71.42 64.55,73.78 69.17,73.78 v69.81,73.14
CSDIS1
  Top 0.254: U1M1.P6 54.88,128.35 R9M1.1
CSDIS2
  Top 0.254: R9M2.1 103.43,143.95 U1M2.P6
CSDIS3
  Top 0.254: R9M3.1 99.96,54.06 U1M3.P6
CSDIS4
  Top 0.254: R9M4.1 57.07,70.93 U1M4.P6
CSM1  (via drill 0.35)
  Top 0.254: C1M1.2 53.3,123.31 | 53.3,123.31 R8M1.1 | 1U3.20 123.32,90.86 123.32,91.5 122.57,92.25 122.21,92.61 119.57,92.61 118.48,93.69 v118.48,104.92 | v107.33,104.95 106.2,106.08 106.2,113.87 104.17,115.9 v101.85,115.9 | v53.93,122.04 53.3,122.67 53.3,123.31
  Bottom 0.254: v101.85,115.9 99.95,115.9 96.62,119.22 56.75,119.22 v53.93,122.04 | v118.48,104.92 118.05,104.92 117.91,105.07 116.97,105.07 116.38,104.48 107.81,104.48 v107.33,104.95
CSM2  (via drill 0.35)
  Top 0.203: 112.47,107.43 112.15,107.76 112.15,107.83 109.89,110.08 109.89,111.27 109.23,111.93
  Top 0.254: C1M2.2 98.38,145.53 | 98.38,145.53 R8M2.1 | 1U3.17 125.27,90.86 125.27,91.5 124.62,92.15 124.61,92.15 122.91,93.86 122.9,93.86 122.78,93.98 120.74,93.98 120.07,94.64 120.07,102.75 120.56,103.24 120.56,103.96 v120.86,104.26 | v112.99,106.16 112.47,106.67 112.47,107.43 | v108.74,113.02 108.74,112.43 109.23,111.93 | v108.54,115.05 108.08,115.51 108.08,116.05 107.64,116.5 107.21,116.5 105.25,118.46 101.35,118.46 92.03,127.77 92.03,147.44 v92.67,148.07 | v97.34,144.74 97.59,144.74 98.38,145.53
  Bottom 0.254: v120.86,104.26 120.78,104.34 120.78,105.44 119.63,106.6 116.56,106.6 115.81,105.85 112.99,105.85 v112.99,106.16 | v108.74,113.02 108.54,113.22 v108.54,115.05 | v92.67,148.07 94,148.07 v97.34,144.74
CSM3  (via drill 0.35)
  Top 0.254: R8M3.1 C1M3.2 100.47,48.12 v100.54,48.12 | v119.75,80.54 121.49,82.28 1U3.2
  Bottom 0.254: v100.54,48.12 98.38,50.29 98.38,55.57 94.67,59.28 94.67,71.24 93.99,71.92 93.99,72.36 93.98,72.37 93.98,73.92 95.07,75.01 96.61,75.01 97.21,74.41 111.72,74.41 112.83,75.53 112.83,82.18 113.95,83.3 116.99,83.3 v119.75,80.54
CSM4  (via drill 0.35)
  Top 0.254: R8M4.1 C1M4.2 51.14,70.42 v51.14,70.35 | v78.7,77.71 75.37,81.04 57.9,81.04 v52.66,75.81 | v121.11,80 122.14,81.03 1U3.3
  Bottom 0.254: v51.14,70.35 51.14,74.28 v52.66,75.81 | v78.7,77.71 80.6,77.71 81.54,76.78 89.51,76.78 92.35,79.62 104.28,79.62 104.97,80.31 110.02,80.31 113.66,83.94 117.43,83.94 121.11,80.26 v121.11,80
DEBUG_RX  (via drill 0.35)
  Top 0.254: 1U4.13 140.01,95.2 141.12,95.2 141.82,95.9 141.82,98.6 142.36,99.14 142.36,106.34 144.09,108.07 144.09,108.63 144.1,108.63 144.1,110.61 149.17,115.68 149.17,122.88 v148.33,123.72 | v147.91,125.85 147.87,125.81 SWD.6
  Bottom 0.254: v148.33,123.72 148.33,125.43 v147.91,125.85
DEBUG_TX
  Top 0.254: 1U4.12 139.51,94.7 141.27,94.7 142.3,95.74 142.3,98.28 142.81,98.78 142.81,106.15 144.56,107.89 144.56,110.42 149.82,115.68 149.82,123.31 148.32,124.81 SWD.5
FDBK  (via drill 0.35)
  Top 0.254: 3POT1.2 69.26,184.63 3POT1.1 | 3R2.2 91.36,182.82 89.71,184.47 3U1.P2 87.79,184.47 86.23,182.91 86.23,181.18 v86.32,181.09
  Bottom 0.254: 3POT1.1 72.8,181.09 v86.32,181.09
GATE1  (via drill 0.35)
  Top 0.254: v106.12,105.02 105.75,105.4 105.75,113.31 103.94,115.11 v102.67,115.11 | v44.41,118.23 42.05,118.23 21.91,138.37 17.05,138.37 GATE1.2 | 1U3.21 122.79,91.38 122.02,92.15 119.38,92.15 117.59,93.94 v117.59,104.31
  Bottom 0.254: v117.59,104.31 117.31,104.02 107.12,104.02 v106.12,105.02 | v44.41,118.23 44.53,118.35 96.48,118.35 99.71,115.11 v102.67,115.11 | GATE1.2 14.08,141.34 R3.2
GATE2  (via drill 0.35)
  Top 0.254: GATE2.2 141.14,73.14 v139.02,73.14 | v127.59,80.76 126.04,82.31 1U3.9
  Bottom 0.254: R4.2 159.8,54.49 GATE2.2 | v139.02,73.14 135.21,73.14 v127.59,80.76
GND  (via drill 0.35)  (227 unrouted)
  Top 0.203: 2U1.6 87.59,71.9 2U1.P$6 | 2U1.9 86.32,70.6 85.05,70.6 | 2U1.9 86.32,71.87 85.05,71.87 | 2U1.9 87.59,71.87 89.49,71.87 | 2U1.9 87.59,70.6 88.86,70.6
  Top 0.254: 132.67,104.26 132.96,103.97 1U4.35 132.96,101.04 133.84,100.16 1U4.23 141.15,100.16 141.44,100.45 141.44,100.8 140.74,101.5 1C8.2 | 1U4.47 128.77,95.66 128.36,95.24 127.05,95.24 1R11.2
  other vias: 74,140.2 115.14,124.58 74.25,55.87 114.76,71.49 114.76,74.67 39.33,61.08 46.31,53.46 48.63,49.08 54.57,47.11 62.82,45.2 67.9,38.85 78.7,37.58 90.13,36.31 99.65,38.22 111.08,40.76 50.76,69.33 116.8,43.93 119.34,46.47 125.22,50.43 127.76,52.97 133.48,57.41 135.38,59.95 139.83,65.67 141.1,69.48 129.03,92.34 145.37,101.72 140.93,103.62 49.92,124.93 50.47,126.7 101.25,148.4 97.14,143.53 102.83,153.79 111.72,151.25 95.84,149.98 61.55,150.61 62.19,146.8 84.29,157.76 86.83,157.13 89.37,152.68 93.18,152.68 94.65,157.59 55.2,149.34 70.45,154.3 71.72,149.85 81.87,42.66 112.22,96.89 109.5,108.43 40.6,139.18 37.42,135.37 143.47,116.96 132.04,139.18 135.85,135.37 112.71,108.32 115.35,109.29 144.01,120.88 119.34,149.98 101.79,44.31 100.05,46.9 108.06,107.06 70.08,178.01 87.33,186.59 74.63,179.6 75.9,179.6 76.53,178.33 75.26,178.33
  pour Top (isolate 0.305, rank 3): 92.03,66.16 87.59,70.6 83.78,70.6 83.14,69.97 81.87,69.97 81.36,70.48 81.36,71.87 82,72.51 83.78,72.51 84.41,71.87 86.95,71.87 87.59,72.51 87.59,80.13 88.22,80.13 88.86,79.49 88.86,75.05 88.22,74.41 88.22,73.14 88.86,72.51 92.03,72.51 93.94,70.6 93.94,66.79 93.3,66.16
  pour Top (isolate 0.305): 72.98,141.72 72.98,139.82 72.35,139.18 72.35,138.55 73.62,137.28 74.25,137.28 74.89,137.91 74.89,140.45 73.62,141.72
  pour Top (isolate 0.305): 66.63,144.26 67.9,142.99 68.54,142.99 70.76,145.22 68.85,147.12 66.63,144.9
  pour Top (isolate 0.305): 116.8,125.85 114.89,125.85 114.26,126.48 113.62,126.48 112.35,125.21 112.35,124.58 112.99,123.94 115.53,123.94 116.8,125.21
  pour Top (isolate 0.305): 120.29,128.07 122.19,129.98 119.97,132.2 119.34,132.2 118.07,130.93 118.07,130.29
  pour Top (isolate 0.305): 72.98,54.09 72.98,56 72.35,56.63 72.35,57.27 73.62,58.54 74.25,58.54 74.89,57.9 74.89,55.36 73.62,54.09
  pour Top (isolate 0.305): 66.63,51.55 67.9,52.82 68.54,52.82 70.44,50.92 68.54,49.01 66.63,50.92
  pour Top (isolate 0.305): 116.8,69.97 114.89,69.97 114.26,69.33 113.62,69.33 112.35,70.6 112.35,71.24 112.99,71.87 115.53,71.87 116.8,70.6
  pour Top (isolate 0.305): 119.34,63.62 118.07,64.89 118.07,65.52 120.29,67.75 122.19,65.84 119.97,63.62
  pour Top (isolate 0.305, rank 5): -3.22,196.97 175.22,196.97 175.22,-0.52 -3.22,-0.52
  pour Bottom (isolate 0.305, rank 5): 175.22,196.97 -3.22,196.97 -3.22,-0.52 175.22,-0.52
INBM1
  Top 0.254: U$4.6 85.65,142.39 86.32,141.72 86.32,133.47 70.32,117.47 61.74,117.47 R6M1.2
INBM2  (via drill 0.35)
  Top 0.254: U$4.4 85.65,151.22 v86.32,151.88 | v95.59,141.98 95.87,141.69 R6M2.2
  Bottom 0.254: v86.32,151.88 95.59,142.61 v95.59,141.98
INBM3  (via drill 0.35)
  Top 0.254: U$5.6 89.21,47.74 v89.49,47.74 | v91.61,47.52 95.41,47.52 97.56,45.38 101.74,45.38 102.87,46.51 R6M3.2
  Bottom 0.254: v89.49,47.74 91.4,47.74 v91.61,47.52
INBM4  (via drill 0.35)
  Top 0.254: U$5.4 89.49,43.65 89.49,42.03 89.49,41.4 v88.86,40.76 | R6M4.2 49.52,62.44 v58.38,53.58 | v69.4,40.26 76.16,40.26 76.66,40.76 v77.23,40.76 | v70.4,42.16 v70.39,42.16 60.48,52.06 v59.01,52.06
  Bottom 0.254: v58.38,53.58 58.38,52.7 v59.01,52.06 | v70.4,42.16 70.4,41.26 v69.4,40.26 | v77.23,40.76 v88.86,40.76
INM1  (via drill 0.35)
  Top 0.254: U$4.1 86.77,147.55 86.77,133.28 84.42,130.92 | 84.42,130.92 v70.2,116.71 | X1.8 109.14,100.45 107.91,100.45 107.65,100.7 v107.65,102.35 | R5M1.1 48.25,128.42 48.25,122 v53.3,116.96 | v101.56,102.35 101.12,102.79 101.12,114.23 98.57,116.78 98.56,116.78 84.42,130.92
  Bottom 0.254: v107.65,102.35 v101.56,102.35 | v53.3,116.96 69.96,116.96 v70.2,116.71
INM2  (via drill 0.35)
  Top 0.254: X1.6 108.81,98.78 108.26,98.78 105.27,101.78 105.27,112.61 104.27,113.61 103.01,113.61 102.04,114.58 102.04,114.61 87.23,129.41 87.23,146.67 89.38,148.82 89.38,150.4 88.86,150.93 U$4.3 v90.13,150.93 | v99.56,150.84 103.23,150.84 R5M2.1
  Bottom 0.254: v90.13,150.93 99.47,150.93 v99.56,150.84
INM3  (via drill 0.35)
  Top 0.254: U$5.1 94.26,55.4 R5M3.1 95.87,57 v95.41,57.47 | X1.4 110.04,96.41 111.36,95.09 111.36,91.8 106.54,86.99 106.54,79.59 109.8,76.32 v109.8,75.57
  Bottom 0.254: v95.41,57.47 93.93,58.94 93.93,70.98 93.49,71.43 93.52,71.46 93.52,74.1 94.88,75.46 96.8,75.46 97.39,74.87 109.11,74.87 v109.8,75.57
INM4  (via drill 0.35)
  Top 0.254: U$5.3 84.73,44.89 83.46,46.16 | R5M4.1 60.98,75.01 66.12,69.88 67.13,69.88 67.68,69.33 v67.9,69.33 | 83.46,46.16 81.87,47.74 81.87,49.01 78.82,52.06 78.82,56.31 78.06,57.07 78.06,58.1 78.18,58.22 78.18,59.05 v77.43,59.81 | X1.2 110.14,94.41 110.45,94.1 110.45,92.18 105.54,87.28 105.54,78.39 v107.76,76.18 | v93.3,57.27 93.3,56 83.46,46.16
  Bottom 0.254: v77.43,59.81 v67.9,69.33 | v93.3,57.27 93.3,57.85 93.02,58.14 93.02,70.56 92.82,70.76 92.82,70.8 92.58,71.05 92.58,74.45 94.5,76.38 97.18,76.38 97.7,75.86 107.45,75.86 v107.76,76.18
L3>L1
  pour Top (isolate 0.508): 85.05,32.5 85.05,22.34 72.98,22.34 72.98,32.5
  pour Bottom (isolate 0.508): 72.98,32.5 72.98,22.34 85.05,22.34 85.05,32.5
LIGHT_INT  (via drill 0.35)
  Top 0.254: 1U4.32 v134.47,104.31
  Bottom 0.254: v134.47,104.31 133.66,103.5 104.22,103.5 J2.1
LSOUT1  (via drill 0.35)
  Top 0.254: v140.93,108.7 141.9,107.73 141.9,99.33 141.36,98.79 141.36,97.91 141.11,97.66 1U4.18
  Bottom 0.254: 1U1.1 132.67,111.03 1C2.1 1R3.2 138.81,108.7 v140.93,108.7
LSOUT2  (via drill 0.35)
  Top 0.254: v49.96,60.92 48.44,62.44 48.44,62.94 48.48,62.98 48.48,63.64 48.45,63.67 48.45,73.39 52.01,76.95 53.16,76.95 57.71,81.5 75.63,81.5 78.36,78.77 v81.53,78.77 | v128.6,86.3 128.59,86.31 128.59,90.65 129.5,91.56 130.13,91.56 132,93.43 132,94.3 133.3,95.6 135.16,95.6 135.94,94.83 136.9,94.83 137.46,94.26 1U4.11
  Bottom 0.254: 1U2.1 60.28,62.56 1R5.2 1C4.1 51.61,62.56 v49.96,60.92 | v81.53,78.77 83.07,77.23 89.32,77.23 92.16,80.07 104.1,80.07 104.78,80.76 109.83,80.76 113.82,84.75 117.44,84.75 122.06,80.13 124.18,80.13 128.6,84.55 v128.6,86.3
LSOUT3  (via drill 0.35)
  Top 0.254: 1U4.10 136.96,91.94 137.35,91.55 v138.4,91.55 | v123.78,87.75 120.84,84.81 1U3.1
  Bottom 0.254: v138.4,91.55 128.85,91.55 125.05,87.75 v123.78,87.75
M1+2  (via drill 0.35)
  Top 0.203: v68.92,120.77 71.12,120.77 Q1M1.3
  Top 0.254: U1M1.P12 60.14,125.13 60.14,124.1 62.07,122.16 v62.77,122.16 | v97.87,133.52 97.37,134.02 97.37,136.63 99.57,138.82 100.07,138.82 U1M2.P12 | Q1M2.3 95.21,128.34 J5.P$1
  Bottom 0.254: v62.77,122.16 67.52,122.16 v68.92,120.77 | 93.3,129.02 J5.P$1 95.28,130.93 v97.87,133.52
  Bottom 1.524: 93.3,129.02 85.05,120.77 v68.92,120.77
  pour Top (isolate 0.305): 96.79,126.17 97.75,127.12 97.75,130.29 96.48,131.56 94.95,131.56 94.95,128.01
MOTOR_SW
  Top 0.254: R1.2 107.91,23.61 106,21.71 J11.P$1
  pour Top (isolate 0.508): 90.76,21.71 90.76,11.55 108.54,11.55 108.54,21.71
  pour Bottom (isolate 0.508): 108.54,21.71 108.54,11.55 90.76,11.55 90.76,21.71
MOUSE_MISO  (via drill 0.35)
  Top 0.254: 1U4.16 139.94,96.69 137.13,96.69 136.86,96.96 v136.86,97.4
  Bottom 0.254: MOUSE.7 104.1,96.64 107.63,100.17 134.09,100.17 v136.86,97.4
MOUSE_MOSI  (via drill 0.35)
  Top 0.254: v136.73,98.67 138.26,97.15 139.96,97.15 1U4.17
  Bottom 0.254: MOUSE.8 105.07,100.66 134.74,100.66 v136.73,98.67
MOUSE_MOT  (via drill 0.35)
  Top 0.254: v128.24,97.06 128.24,96.97 128.55,96.66 1U4.45
  Bottom 0.254: MOUSE.4 103.59,90.02 105.31,91.74 105.31,94.04 109.95,98.68 126.62,98.68 v128.24,97.06
MOUSE_RST  (via drill 0.35)
  Top 0.254: v128.04,96 128.2,96.16 1U4.46
  Bottom 0.254: MOUSE.3 106,89.15 106,94.08 110.08,98.16 125.89,98.16 v128.04,96
MOUSE_SCK  (via drill 0.35)
  Top 0.254: 1U4.15 139.93,96.2 136.93,96.2 v135.79,97.34
  Bottom 0.254: MOUSE.6 103.59,94.23 109.04,99.68 133.51,99.68 135.79,97.4 v135.79,97.34
MOUSE_SS  (via drill 0.35)
  Top 0.254: 1U4.14 136.27,95.66 v134.63,97.3
  Bottom 0.254: MOUSE.5 103.33,92.05 104.86,93.57 104.86,94.23 109.77,99.14 132.79,99.14 v134.63,97.3
N$1  (via drill 0.35)
  Top 0.203: v88.22,31.87 88.22,34.2 v88.85,34.82
  Top 0.254: LED1.1 25.77,68.7 v31.07,68.7 | v87.9,181.16 87.9,164.08 89.14,162.85 89.14,160.81 v89.09,160.76 | LED2.1 147.62,126.61 145.26,126.61 144.5,125.84 v142.61,125.84
  Top 0.508: U$17.P$1 72.56,102.57 C3.1
  Bottom 0.203: 1D40.A 88.45,12.56 86.9,14.11 86.9,29.92 88.22,31.23 v88.22,31.87
  Bottom 0.254: 1D16.A 144.61,124.2 146.26,119.12 1D17.A 148.92,113.71 148.92,109.38 149.11,108.32 1D18.A 151.01,102.64 151.01,99.76 151.01,99.74 149.93,98.66 149.93,97.37 149.82,97.27 149.82,92.76 1D19.A 149.48,90.33 149.07,87.28 148.92,86.44 148.92,82.11 1D20.A 146.86,78.13 146.29,76.81 146.05,76.14 1D21.A 141.56,66.54 141.54,66.5 1D22.A 135.48,57.76 135.22,57.45 1D23.A 127.86,49.97 127.05,49.29 123.65,45.89 1D24.A 118.83,43.55 118,43.06 1D25.A 109.18,38.87 109.01,38.87 108,38.51 1D26.A 98.42,35.94 97.37,35.75 1D27.A v88.85,34.82 87.49,34.89 86.41,34.89 1D28.A 76.19,35.84 74.86,36.08 1D29.A 65.54,38.68 65.38,38.74 1D30.A 57.89,41.92 55.05,43.59 1D31.A 50.25,45.89 46.66,49.48 46.63,49.48 46.06,50 1D32.A 38.91,57.17 38.46,57.65 38.46,57.68 34.93,61.21 1D33.A 32.62,66.02 32.35,66.43 32.1,66.86 30.99,67.98 | 1D16.A 141.8,128.95 141.26,129.88 1D15.A 138.97,134.61 135.57,138.01 134.88,138.83 1D14.A 127.64,145.98 127.15,146.4 1D13.A 118.93,152.22 118,152.75 1D12.A 108.89,156.95 108.42,157.12 1D11.A 102.75,159.88 98.42,159.88 97.37,160.06 1D10.A 89.49,161.17 | 89.49,161.17 87.73,161.17 87.49,160.93 86.41,160.93 86.18,161.17 1D9.A 80.6,160.77 76.18,160 75.48,159.88 71.15,159.88 1D8.A 66.63,157.6 65.9,157.31 65.31,157.1 | 65.31,157.1 64.89,156.94 60.15,155.47 | 65.31,157.1 | 1D7.A 60.15,155.47 | 60.15,155.47 55.75,152.65 54.05,151.63 1D6.A 51.5,150.39 45.68,145.53 1D5.A 41.73,142.49 39.01,138.81 38.33,138.01 34.93,134.61 1D4.A 33.53,131.61 32.98,130.42 32.09,128.9 31.24,127.65 1D3.A 27.93,119.94 27.59,119.03 1D2.A 25,109.42 24.79,108.16 1D1.A 23.97,103.17 23.97,99.81 23.97,98.04 1D36.A 24.83,87.48 25.1,85.9 1D35.A 27.54,76.92 28.2,75.18 1D34.A 29.4,69.57 30.99,67.98
  Bottom 0.254: v31.07,68.7 31.07,68.06 30.99,67.98 | 1D38.A 88.45,181.72 v87.9,181.16 | v89.09,160.76 89.49,161.17 | v142.61,125.84 143.41,125.84 1D16.A
  Bottom 0.508: U$17.P$1 32.34,103.62 28.53,99.81 23.97,99.81 | U$22.P$1 139.02,82.67 1R1.1 138.06,80.02 138.06,78.54 138.47,78.13 146.86,78.13
N$2
  Bottom 0.254: 1U2.16 65.72,49.33 65.72,49.32 66.81,48.23 66.82,48.23 66.85,48.22 66.88,48.22 67.07,48.22 arc-45 69.33,47.28 70.49,46.12 arc-45 71.15,44.53 74.08,41.59 103.46,41.59 105.64,39.41 1PT26.E
N$3  (1 unrouted)
  Bottom 0.508: 1R1.2 140.89,79.28
N$4
  Bottom 0.254: 1PT27.E 94.36,40 75.03,40 70.69,44.34 arc45 70.03,45.93 69.14,46.82 arc45 66.88,47.76 arc-45 66.43,47.95 65.51,48.86 arc-45 65.07,49.94 1U2.17
N$5
  Bottom 0.254: 1PT28.E 83.12,39.49 74.9,39.49 70.23,44.15 arc45 69.58,45.74 68.95,46.37 arc45 66.69,47.3 arc-45 65.98,47.6 65.35,48.22 arc-45 64.42,50.49 1U2.18
N$6
  Bottom 0.254: 1PT29.E 76.14,37.6 71.08,42.66 71.06,42.66 69.78,43.95 arc45 69.11,45.56 68.76,45.91 arc45 66.5,46.85 arc-45 65.64,47.2 64.7,48.14 arc-45 63.77,50.4 1U2.19
N$7
  Bottom 0.254: 1U2.20 63.12,49.36 arc-45 62.18,47.1 59.44,44.36 arc45 59.15,43.66 59.15,43.56 arc45 59.42,42.91 59.66,42.67 1PT30.E
N$8
  Bottom 0.254: 1PT31.E 62.47,50.64 1U2.21
N$9
  Bottom 0.254: 1PT32.E 59.58,50.22 arc45 61.77,55.51 1U2.22
N$10
  Bottom 0.254: 1PT33.E 46.32,57.89 50.12,54.09 57.18,54.09 57.68,54.59 59.15,54.59 59.67,54.07 60.72,54.07 61.17,54.52 1U2.23
N$11
  Bottom 0.254: 1U2.2 61.17,64.08 60.8,64.44 50.23,64.44 48.03,66.64 33.18,66.64 1PT34.E
N$12  (via drill 0.35)
  Top 0.254: v37.42,69.33 31.71,75.05 v29.8,75.05
  Bottom 0.254: 1U2.3 61.82,64.71 61.63,64.9 58.63,64.9 55.47,68.06 38.69,68.06 v37.42,69.33 | v29.8,75.05 28.45,76.39 1PT35.E
N$13  (via drill 0.35)
  Top 0.254: v51.11,79.77 45.68,85.21 v26.63,85.21
  Bottom 0.254: 1U2.4 62.47,65.08 62.19,65.36 58.82,65.36 55.56,68.62 55.56,75.94 52.76,78.73 52.35,78.73 51.31,79.77 v51.11,79.77 | v26.63,85.21 25.65,86.19 1PT36.E
N$14  (via drill 0.35)
  Top 0.254: v52.66,79.49 36.15,96 v25.36,96
  Bottom 0.254: 1U2.5 63.12,65.52 62.82,65.82 59.01,65.82 56.01,68.81 56.01,76.76 54.62,78.16 54.58,78.16 53.25,79.49 v52.66,79.49 | v25.36,96 24.7,96.66 1PT1.E
N$15  (via drill 0.35)
  Top 0.254: v52.71,80.72 26.63,106.81 v26.63,107.43
  Bottom 0.254: v52.71,80.72 52.71,80.68 54.77,78.62 54.81,78.62 56.47,76.95 56.47,69.26 59.46,66.27 63.34,66.27 63.77,65.85 1U2.6 | v26.63,107.43 25.65,108.41 1PT2.E
N$16  (via drill 0.35)
  Top 0.254: v54.45,80.01 54.45,80.65 52.84,82.26 52.84,103.62 36.33,120.13 v29.8,120.13
  Bottom 0.254: v54.45,80.01 57.11,77.36 57.11,69.27 59.65,66.73 64.09,66.73 64.42,66.4 1U2.7 | v29.8,120.13 28.87,119.2 1PT3.E
N$17  (via drill 0.35)
  Top 0.254: v54.9,81.34 53.93,82.31 53.93,105.52 50.3,109.15 50.3,113.61 v34.25,129.66
  Bottom 0.254: v54.9,81.34 57.92,78.32 57.92,69.14 59.88,67.19 64.8,67.19 65.07,66.92 1U2.8 | v34.25,129.66 33.62,129.03 1PT4.E
N$18  (via drill 0.35)
  Top 0.254: v38.69,136.64 47.79,127.54 47.79,121.82 52.03,117.58 52.03,109.34 55.2,106.16 v55.2,82.67
  Bottom 0.254: v55.2,82.67 58.38,79.49 58.38,69.33 60.06,67.64 65,67.64 65.72,66.93 1U2.9 | 1PT5.E 39.26,137.22 v38.69,136.64
N$19
  Bottom 0.254: 1U1.16 127.24,120.75 129.83,123.34 129.83,124.57 123.47,130.93 123.47,138.12 119.86,141.72 109.75,141.72 96.7,154.78 74.62,154.78 68.35,148.51 56.21,148.51 53.3,145.59 1PT6.E
N$20
  Bottom 0.254: 1R2.2 123.84,115.96 126.26,115.96 126.83,116.52 126.83,117.15 126.59,117.4 1U1.15
N$21
  Bottom 0.254: 1U1.17 127.89,120.75 130.28,123.15 130.28,124.76 123.92,131.12 123.92,138.3 119.97,142.26 109.87,142.26 96.89,155.24 74.43,155.24 68.16,148.97 58.67,148.97 1PT7.E
N$22
  Bottom 0.254: 1U1.18 128.54,120.76 131.3,123.52 131.3,133.47 130.43,134.34 130.2,134.34 121.83,142.71 110.06,142.71 97.08,155.69 76.79,155.69 74.25,158.23 1PT8.E
N$23
  Bottom 0.254: 1PT9.E 76.43,159.5 86.32,159.5 89.49,156.33 97.09,156.33 110.24,143.17 122.02,143.17 130.39,134.79 130.69,134.79 131.76,133.72 131.76,123.33 129.19,120.76 1U1.19
N$24
  Bottom 0.254: 1PT10.E 87.14,159.97 94.1,159.97 110.43,143.63 122.2,143.63 130.58,135.25 130.88,135.25 132.21,133.91 132.21,123.14 129.84,120.77 1U1.20
N$25
  Bottom 0.254: 1PT11.E 97.76,156.95 110.45,144.26 122.22,144.26 130.77,135.71 131.06,135.71 132.67,134.1 132.67,122.95 130.49,120.77 1U1.21
N$26  (via drill 0.35)
  Top 0.254: v131.91,120.88 131.91,135.64 v131.09,136.47
  Bottom 0.254: 1U1.22 131.14,120.1 v131.91,120.88 | 1PT12.E 116.8,151.88 116.8,149.97 119.4,147.36 119.44,147.14 121.87,145.44 130.49,136.82 130.73,136.82 v131.09,136.47
N$27  (via drill 0.35)
  Top 0.254: v132.67,120.13 v132.67,136.01
  Bottom 0.254: 1U1.23 131.79,119.25 v132.67,120.13 | 1PT13.E 118.08,149.33 119.82,147.58 119.86,147.41 122.16,145.79 130.67,137.28 131.4,137.28 v132.67,136.01
N$28  (via drill 0.35)
  Top 0.254: v133.31,109.82 133.31,119.69 133.43,119.82 133.43,135.5 v133.94,136.01
  Bottom 0.254: v133.31,109.82 132.02,109.82 131.79,110.06 1U1.2 | v133.94,136.01 132.04,137.91 130.77,137.91 126.96,141.71 1PT14.E
N$29  (via drill 0.35)
  Top 0.254: v133.87,137.19 134.7,136.35 134.7,134.42 134.58,134.3 134.58,110.02 133.62,109.06 132.74,109.06 v132.52,108.85
  Bottom 0.254: 1PT15.E 133.9,137.19 v133.87,137.19 | v132.52,108.85 132.26,108.85 131.14,109.97 1U1.3
N$30  (via drill 0.35)
  Top 0.254: v140.02,128.18 140.02,115.34 138.95,114.28 138.95,112.27 134.75,108.07 131.89,108.07 v131.48,108.48
  Bottom 0.254: 1PT16.E v140.02,128.19 v140.02,128.18 | v131.48,108.48 131.18,108.78 131.18,108.83 130.49,109.52 1U1.4
N$31  (via drill 0.35)
  Top 0.254: v145.46,117.86 143.72,116.13 v142.14,116.13 | v140.17,114.42 139.41,113.66 139.41,112.08 134.76,107.43 131.21,107.43 130.42,108.23 v130.42,108.51
  Bottom 0.254: 1PT17.E 145.45,117.88 v145.46,117.86 | v142.14,116.13 140.43,114.42 v140.17,114.42 | 1U1.5 129.84,109.34 130.42,108.75 v130.42,108.51
N$32
  Bottom 0.254: 1PT18.E 147.94,109.04 147.94,109.2 147.49,109.65 146.64,109.65 144.53,107.54 137.88,107.54 136.39,109.02 133.85,109.02 132.55,107.72 130.08,107.72 129.19,108.61 1U1.6
N$33  (via drill 0.35)
  Top 0.254: v147.18,108.89 147.48,108.59 148.28,108.59 150.23,106.64 v150.23,100.03
  Bottom 0.254: 1PT19.E 149.2,99 v150.23,100.03 | v147.18,108.89 145.37,107.08 137.69,107.08 136.2,108.57 134.04,108.57 132.74,107.26 129.85,107.26 128.63,108.48 128.63,110.03 128.54,110.13 1U1.7
N$34  (via drill 0.35)
  Top 0.254: v147.28,88.26 147.44,88.42 147.44,92.97 149.46,94.99 149.46,106.76 148.44,107.78 147.49,107.78 v147.44,107.83
  Bottom 0.254: 1U1.8 128.01,110.67 128.01,110.01 128.17,109.84 128.17,108.24 129.6,106.81 132.93,106.81 134.23,108.11 136.01,108.11 137.5,106.62 146.23,106.62 v147.44,107.83 | v147.28,88.26 148.25,87.28 1PT20.E
N$35  (via drill 0.35)
  Top 0.254: v148.13,107.02 148.13,106.59 149,105.72 149,95.18 144.1,90.28 v144.1,76.95
  Bottom 0.254: 1PT21.E 144.44,76.62 v144.1,76.95 | 1U1.9 127.36,110.67 127.36,110.01 127.71,109.65 127.71,109.02 127.59,108.9 127.59,108.07 129.31,106.35 133.12,106.35 134.42,107.65 135.82,107.65 137.31,106.16 147.28,106.16 v148.13,107.02
N$36  (1 unrouted)
  Bottom 0.508: U$27.P$1 140.29,83.94
N$37
  Bottom 0.254: 3R4.1 67.31,179.87 3POT1.3
N$38
  Bottom 0.254: 1R4.2 68.75,57.9 67.27,57.9 66.37,57 1U2.15
N$39  (via drill 0.35)  (1 unrouted)
  Top 0.254: U1M4.P12 55.26,64.25 56.93,64.25 v61.08,68.4
  Bottom 0.254: v61.08,68.4 60.38,69.11 60.38,70.6 60.38,70.7 J3.P$1
  pour Top (isolate 0.305): 67.9,71.24 65.59,73.55 65.59,76.64 67.58,76.64 69.17,75.05 69.17,71.24
N$40  (via drill 0.35)  (1 unrouted)
  Top 0.254: U1M3.P12 105.72,51.33 v105.72,50.28 | 99.13,66.79 Q1M3.3
  Bottom 0.254: J4.P$1 95.21,72.51 95.21,59.81 96.62,58.4 97.6,58.4 v105.72,50.28
  pour Top (isolate 0.305): 95.08,72 99.02,68.06 99.02,65.52 99.65,64.89 101.56,66.79 101.56,68.06 99.02,70.6 99.02,71.87 96.98,73.91
N$56
  Top 0.254: 1R6.2 126.69,86.96 1U3.15
N$58  (via drill 0.35)  (1 unrouted)
  Top 0.254: U1M1.P23 | U1M1.P23 72.31,142.96 C3M1.1 72.41,142.99 v74.25,142.99 | 69.17,139.82 | U1M1.P23 69.17,139.82 | U1M1.SLUG1 64.73,135.37
  Top 1.016: 64.73,135.37 69.17,139.82
  Bottom 0.254: C2M1.+ 82.51,142.99 80.6,142.99
  Bottom 1.016: v74.25,142.99 80.6,142.99
  pour Top (isolate 0.305, rank 3): 53.93,131.56 60.92,124.58 74.89,124.58 83.78,133.47 83.78,142.36 83.14,142.99 81.24,142.99 79.33,141.09 79.33,134.1 74.89,129.66 68.54,129.66 61.55,136.64 57.74,136.64 53.93,132.83
N$59
  Top 0.254: R2M1.1 52.03,129.66 54.77,129.66 U1M1.P5
N$60
  Top 0.254: U1M1.P4 54.39,130.7 50.92,130.7 R5M1.2
N$61
  Top 0.254: U1M1.P9 58.36,127.11 57.93,126.67 57.93,124.99 58.34,124.58 R1M1.1
N$62
  Top 0.254: U1M1.P10 58.38,126.2 58.38,125.18 58.89,124.67 58.89,123.97 59.61,123.25 R6M1.1
N$63
  Top 0.254: R10M1.2 R8M1.2 55.8,126.45 U1M1.P8
N$64
  Top 0.254: U1M1.P7 55.02,127.08 R7M1.1
N$65
  Top 0.203: D2M2.A 123.8,149.93
  Top 0.254: D1M2.C D2M2.A | 123.8,149.93 R12M2.1
N$66  (via drill 0.35)  (1 unrouted)
  Top 0.254: 114.89,129.66 U1M2.P23 116.25,128.24 C3M2.1 118.7,125.78 v118.7,125.21 | 107.91,136.64 110.45,134.1 | 107.91,136.64 | 107.91,136.64 U1M2.SLUG1 | U1M2.SLUG1
  Top 1.016: 110.45,134.1 114.89,129.66
  Bottom 0.203: 118.7,118.48 118.7,116.96 C2M2.+
  Bottom 1.016: v118.7,125.21 118.7,118.48
  pour Top (isolate 0.305, rank 3): 107.27,144.26 100.29,137.28 100.29,124.58 109.81,115.05 118.7,115.05 118.7,116.96 116.8,118.86 109.81,118.86 105.37,123.31 105.37,130.93 112.35,137.91 112.35,140.45 108.54,144.26
N$67
  Top 0.254: R2M2.1 104.73,146.8 104.73,144.06 U1M2.P5
N$68
  Top 0.254: R5M2.2 106,148.07 106,146.17 105.37,145.53 105.37,144.84 U1M2.P4
N$69
  Top 0.254: U1M2.P9 102.05,141.09 100.29,141.09 99.88,140.68 98.54,140.68 R1M2.1
N$70
  Top 0.254: R6M2.1 97.75,139.22 97.94,139.41 98.52,139.41 99.33,140.23 100.07,140.23 100.29,140.45 101.27,140.45 U1M2.P10
N$71
  Top 0.254: U1M2.P8 101.52,143.03 R8M2.2 R10M2.2
N$72
  Top 0.254: R7M2.1 102.16,143.81 U1M2.P7
N$73
  Top 0.254: R12M3.1 123.81,48.34 D2M3.A D1M3.C
N$74  (via drill 0.35)  (1 unrouted)
  Top 0.254: U1M3.SLUG1 110.45,61.71 | 114.89,66.16 U1M3.P23 117.4,68.66 C3M3.1 118.07,70.04 v118.07,70.6